# Altium project FPGA_Quatro.PrjPcb
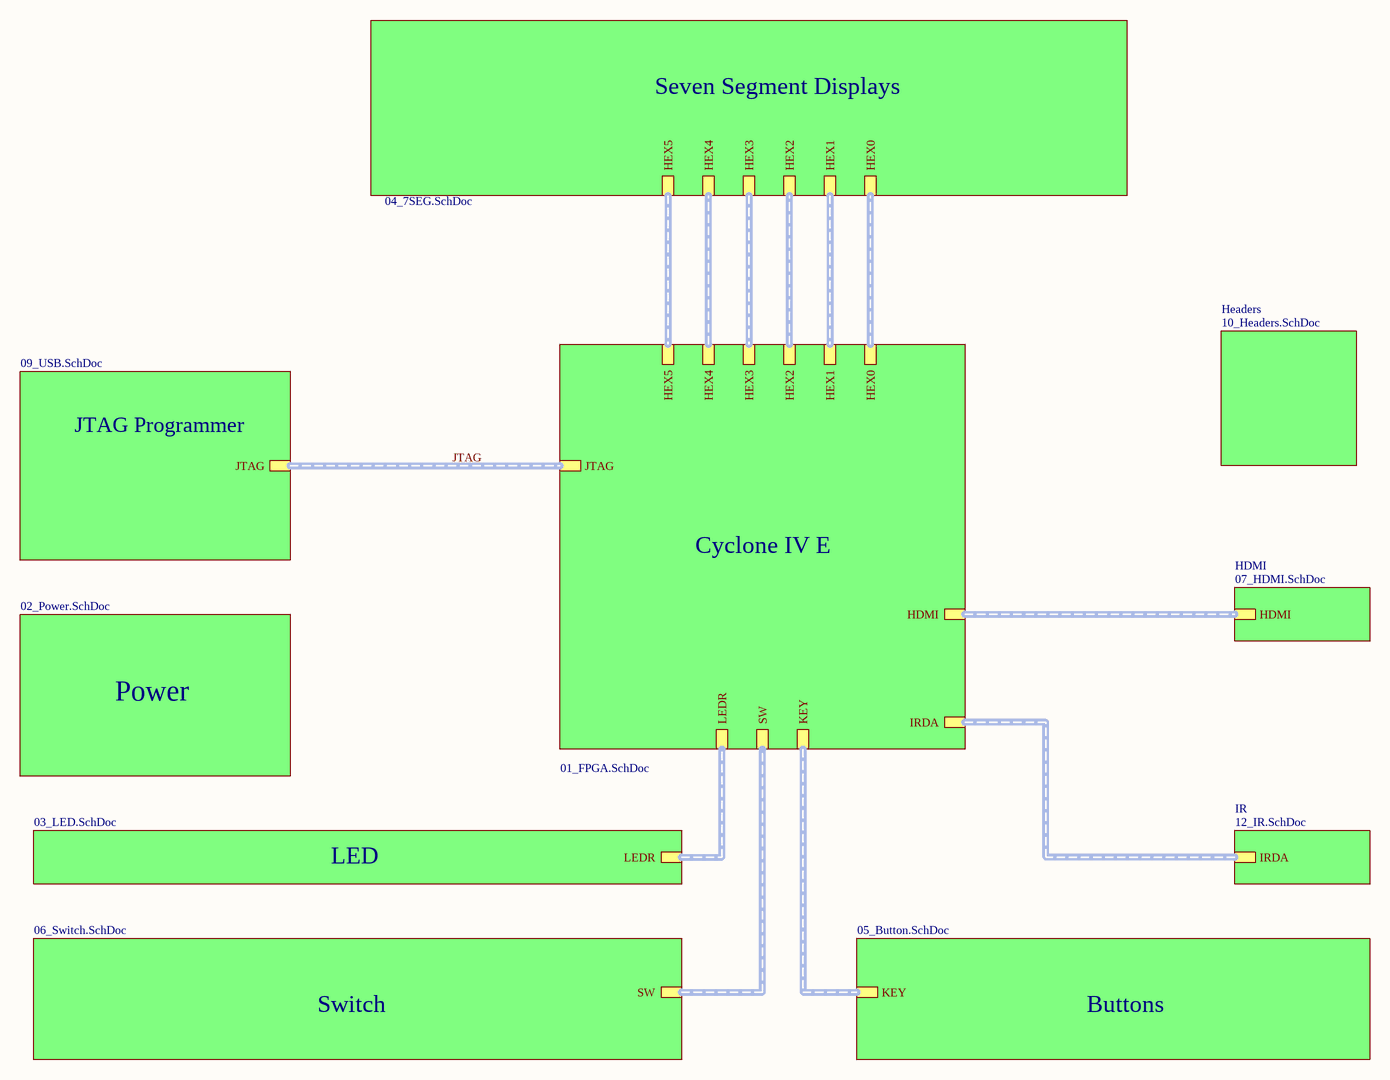
[diagram p0: FPGA_Quatro_SCH_main.SchDoc]
11 sheets, 170 parts. Net scope: hierarchical (ports join the sheet entries above them; power ports are global).
Board file: FPGA_Quatro_PCB.PcbDoc
Sheets:
  FPGA_Quatro_SCH_main.SchDoc
    Cyclone IV E = 01_FPGA.SchDoc
    Power = 02_Power.SchDoc
    LED = 03_LED.SchDoc
    Seven Segment Displays = 04_7SEG.SchDoc
    Buttons = 05_Button.SchDoc
    Switch = 06_Switch.SchDoc
    Headers = 10_Headers.SchDoc
    HDMI = 07_HDMI.SchDoc
    IR = 12_IR.SchDoc
    JTAG Programmer = 09_USB.SchDoc

## Sheet FPGA_Quatro_SCH_main.SchDoc
size A3

### Sub-sheets
Buttons = 05_Button.SchDoc: KEY (harness KEY)
Cyclone IV E = 01_FPGA.SchDoc: JTAG (harness JTAG), LEDR (harness LEDR), SW (harness SW), KEY (harness KEY), HEX4 (harness HEX4), HEX3 (harness HEX3), HEX2 (harness HEX2), HEX0 (harness HEX0), HEX5 (harness HEX5), HEX1 (harness HEX1), HDMI (harness HDMI), IRDA (harness IRDA)
HDMI = 07_HDMI.SchDoc: HDMI (harness HDMI)
Headers = 10_Headers.SchDoc: no entries
IR = 12_IR.SchDoc: IRDA (harness IRDA)
JTAG Programmer = 09_USB.SchDoc: JTAG (harness JTAG)
LED = 03_LED.SchDoc: LEDR (harness LEDR)
Power = 02_Power.SchDoc: no entries
Seven Segment Displays = 04_7SEG.SchDoc: HEX3 (harness HEX3), HEX1 (harness HEX1), HEX0 (harness HEX0), HEX2 (harness HEX2), HEX4 (harness HEX4), HEX5 (harness HEX5)
Switch = 06_Switch.SchDoc: SW (harness SW)

### Buses and harness runs
harness JTAG = sheet Cyclone IV E/JTAG = sheet JTAG Programmer/JTAG
harness sheet Buttons/KEY = sheet Cyclone IV E/KEY
harness sheet Cyclone IV E/HDMI = sheet HDMI/HDMI
harness sheet Cyclone IV E/HEX0 = sheet Seven Segment Displays/HEX0
harness sheet Cyclone IV E/HEX1 = sheet Seven Segment Displays/HEX1
harness sheet Cyclone IV E/HEX2 = sheet Seven Segment Displays/HEX2
harness sheet Cyclone IV E/HEX3 = sheet Seven Segment Displays/HEX3
harness sheet Cyclone IV E/HEX4 = sheet Seven Segment Displays/HEX4
harness sheet Cyclone IV E/HEX5 = sheet Seven Segment Displays/HEX5
harness sheet Cyclone IV E/IRDA = sheet IR/IRDA
harness sheet Cyclone IV E/LEDR = sheet LED/LEDR
harness sheet Cyclone IV E/SW = sheet Switch/SW

## Sheet 01_FPGA.SchDoc
size A2
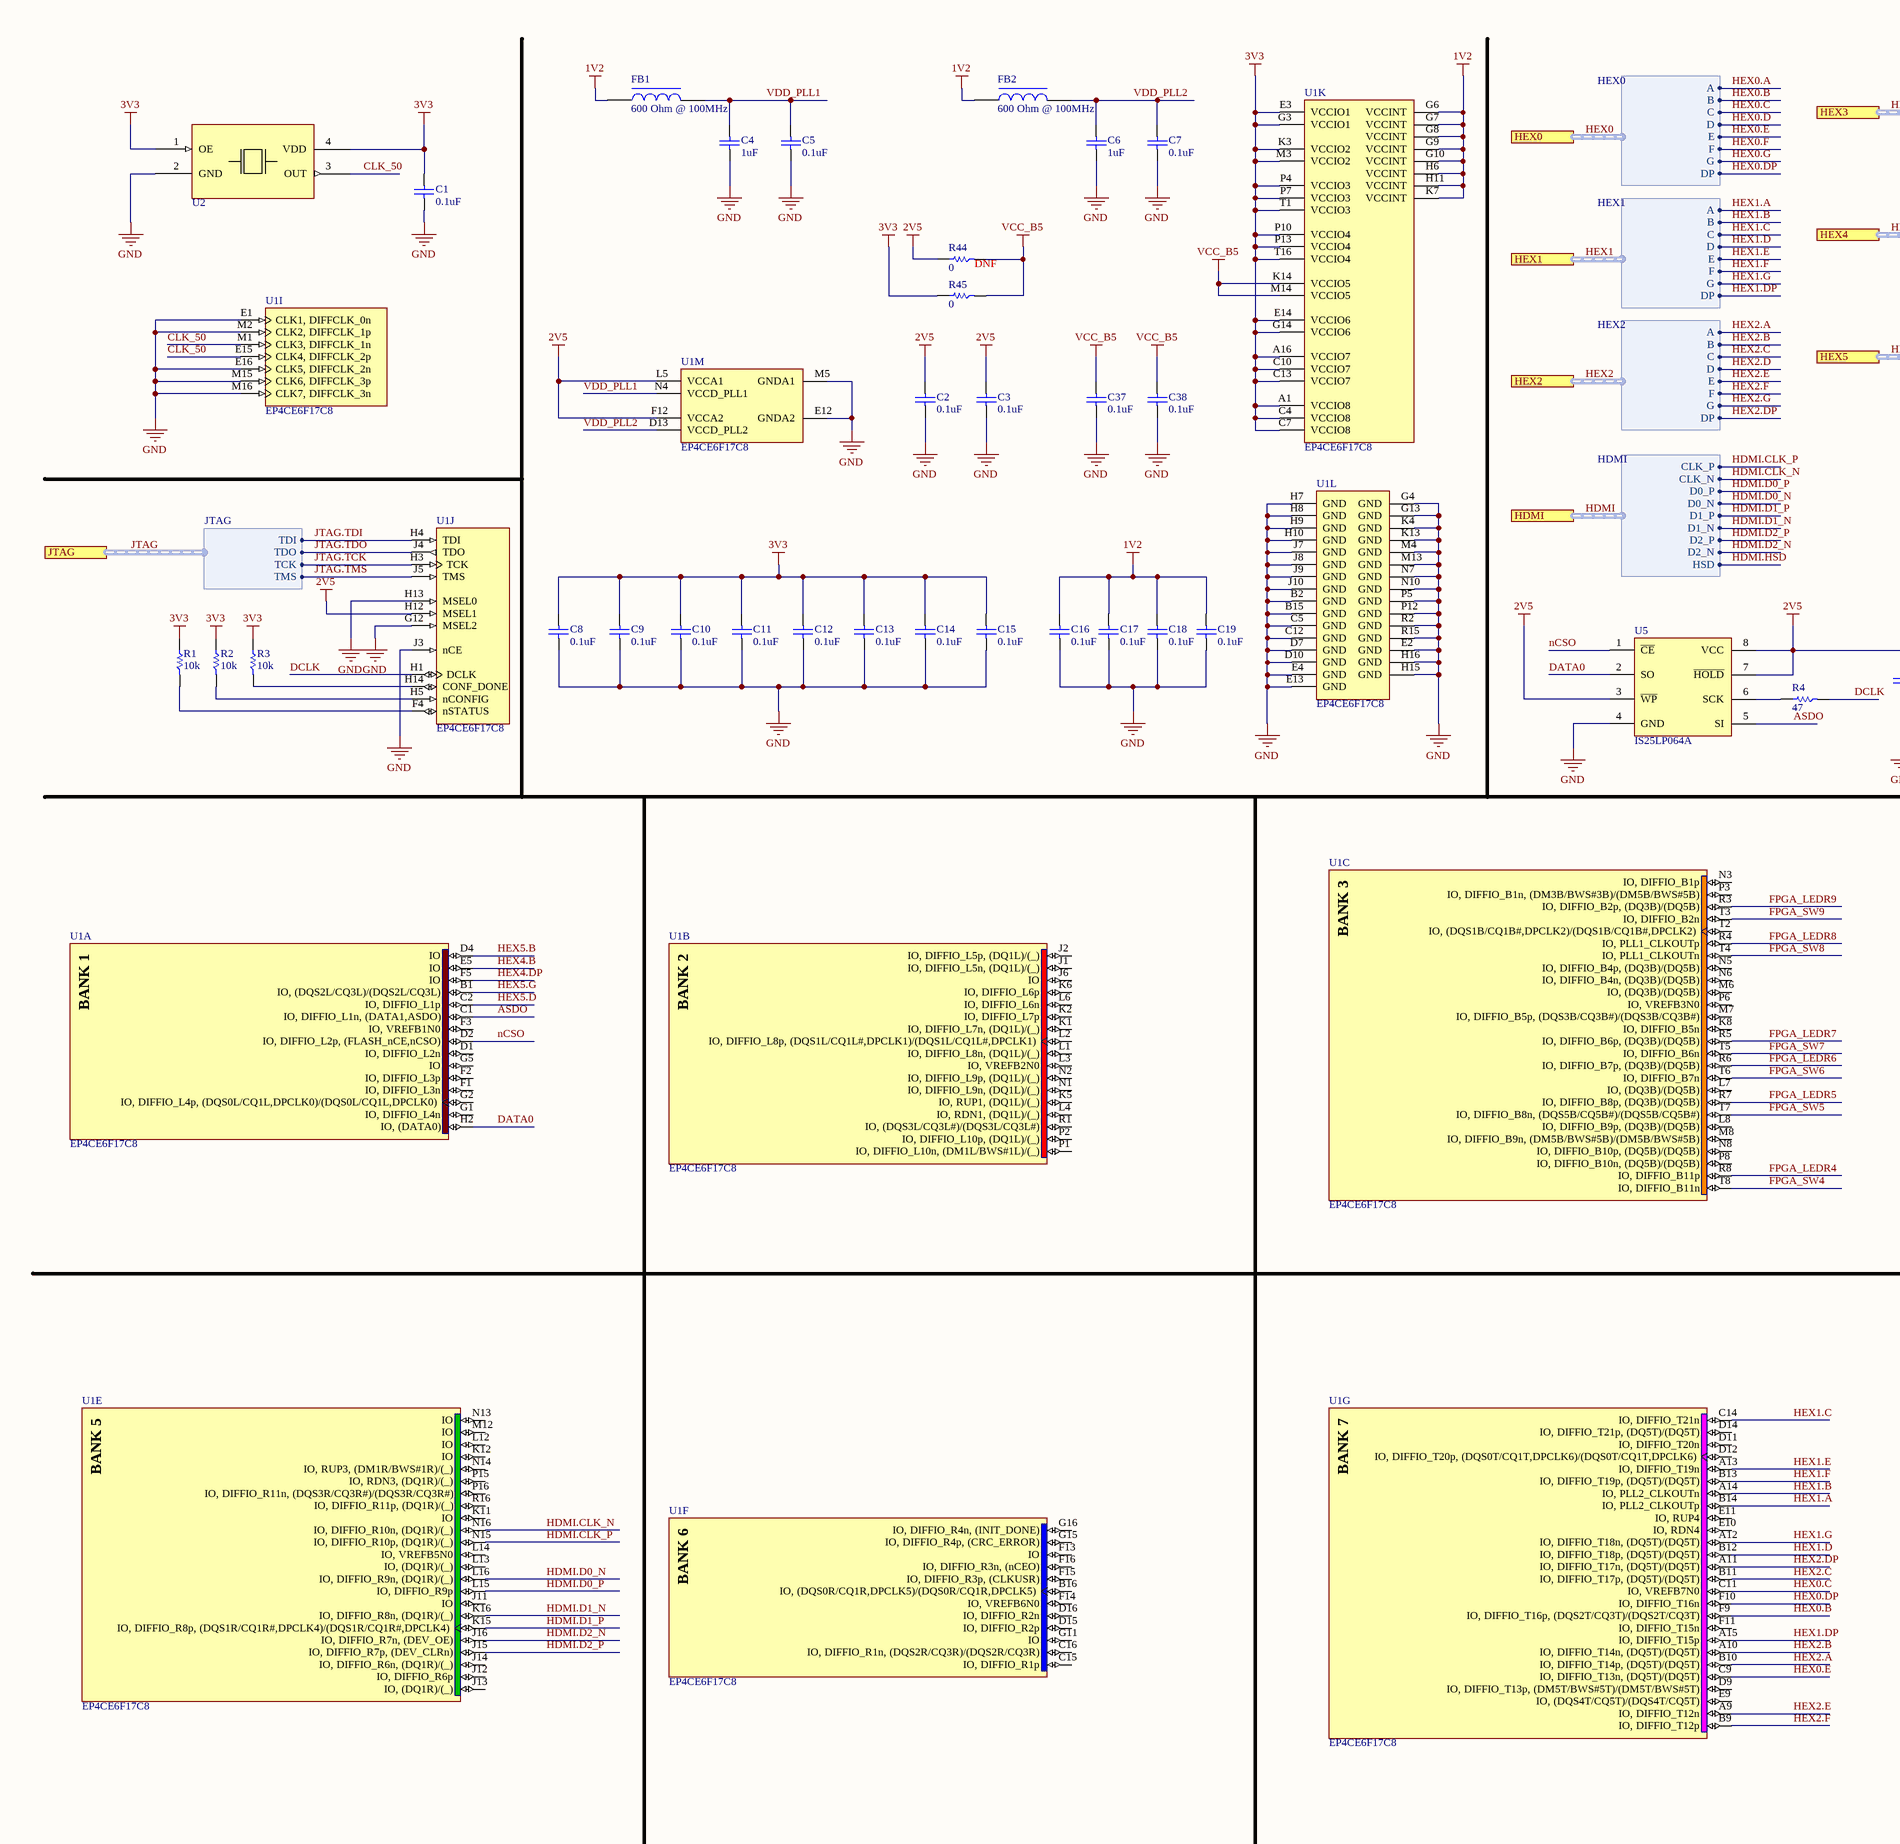
[diagram p1: 01_FPGA.SchDoc, left]
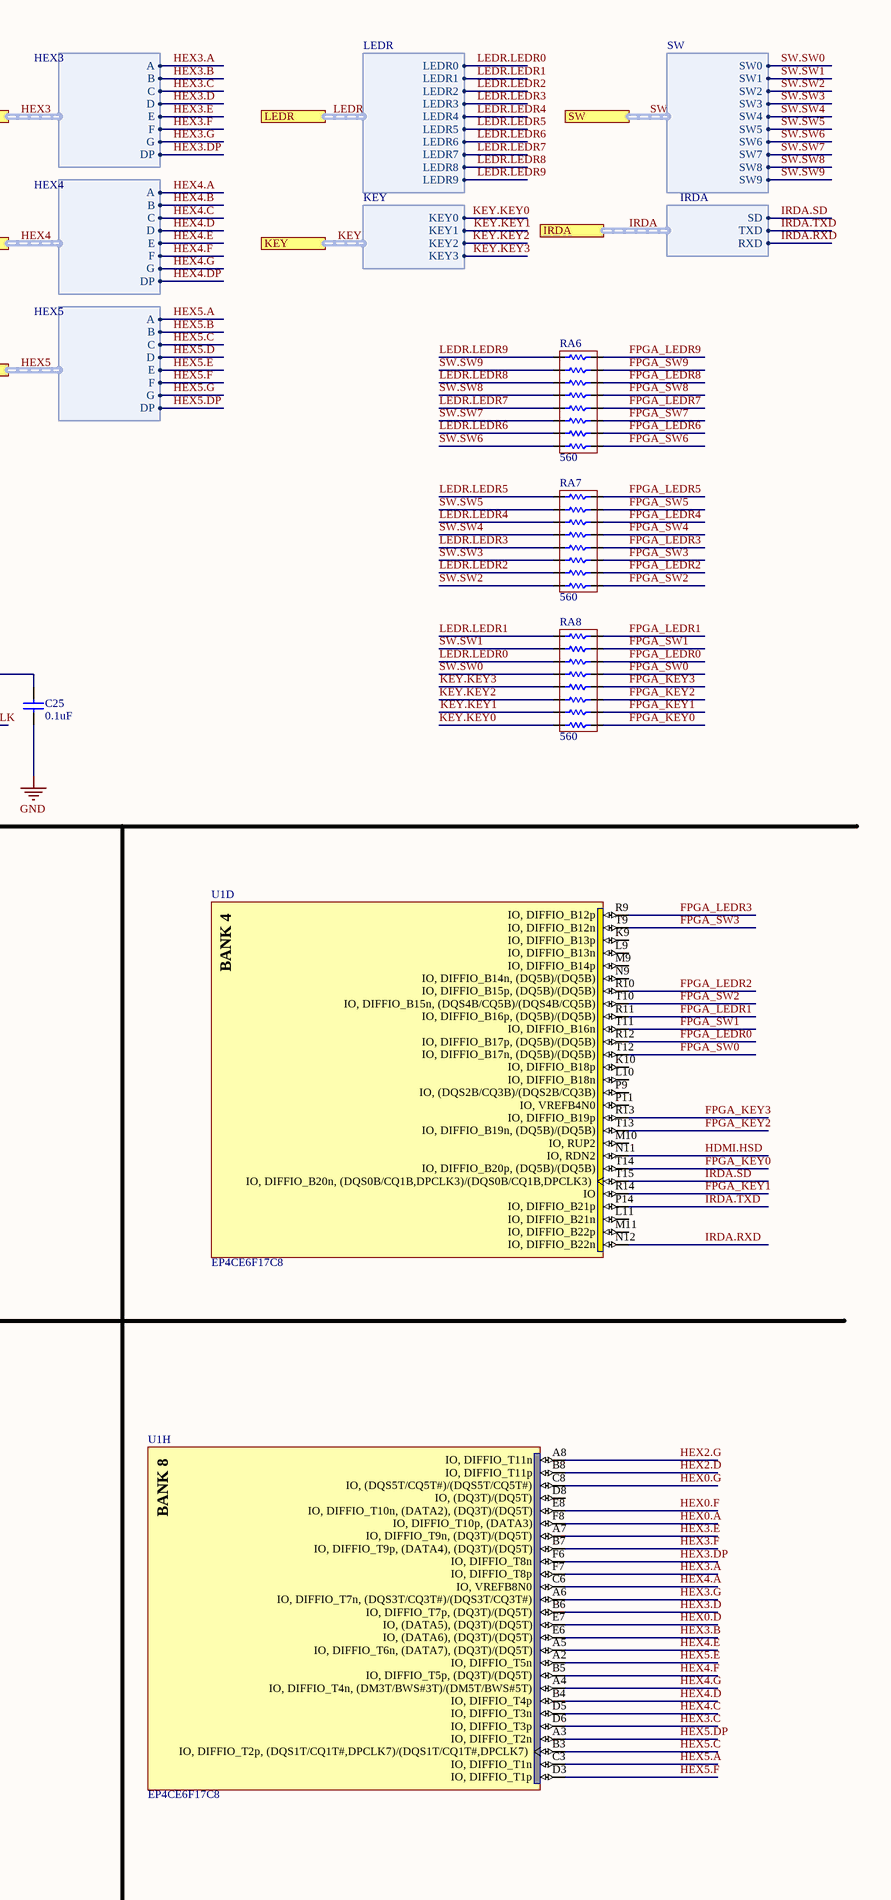
[diagram p2: 01_FPGA.SchDoc, right]

### Parts
C1  0.1uF  [CAP0603R]
C2  0.1uF  [CAP0603R]
C3  0.1uF  [CAP0603R]
C4  1uF  [CAP0603R]
C5  0.1uF  [CAP0603R]
C6  1uF  [CAP0603R]
C7  0.1uF  [CAP0603R]
C8  0.1uF  [CAP0603R]
C9  0.1uF  [CAP0603R]
C10  0.1uF  [CAP0603R]
C11  0.1uF  [CAP0603R]
C12  0.1uF  [CAP0603R]
C13  0.1uF  [CAP0603R]
C14  0.1uF  [CAP0603R]
C15  0.1uF  [CAP0603R]
C16  0.1uF  [CAP0603R]
C17  0.1uF  [CAP0603R]
C18  0.1uF  [CAP0603R]
C19  0.1uF  [CAP0603R]
C25  0.1uF  [CAP0603R]
C37  0.1uF  [CAP0603R]
C38  0.1uF  [CAP0603R]
FB1  600 Ohm @ 100MHz  [RES0805R]
FB2  600 Ohm @ 100MHz  [RES0805R]
R1  10k  [RES0603R]
R2  10k  [RES0603R]
R3  10k  [RES0603R]
R4  47  [RES0603R]
R44  Load: DNF  [RES0402R]  (hidden comment: 0)
R45  0  [RES0402R]
RA6  value 560  [EXB-2HV]  (hidden comment: Resistor Array)
RA7  value 560  [EXB-2HV]  (hidden comment: Resistor Array)
RA8  value 560  [EXB-2HV]  (hidden comment: Resistor Array)
U1  EP4CE6F17C8  [FBGA256]  (parts A,B,C,D,E,F,G,H,I,J,K,L,M of 13)
U2  Oscillator  [CRYSTAL_7x5]  (value not drawn)
U5  IS25LP064A  [SOIC-8]

### Ports
HDMI (harness HDMI), HEX0 (harness HEX0), HEX1 (harness HEX1), HEX2 (harness HEX2), HEX3 (harness HEX3), HEX4 (harness HEX4), HEX5 (harness HEX5), IRDA (harness IRDA), JTAG (harness JTAG), KEY (harness KEY), LEDR (harness LEDR), SW (harness SW)

### Harnesses
JTAG: TDI, TDO, TCK, TMS
LEDR: LEDR0, LEDR1, LEDR2, LEDR3, LEDR4, LEDR5, LEDR6, LEDR7, LEDR8, LEDR9
SW: SW0, SW1, SW2, SW3, SW4, SW5, SW6, SW7, SW8, SW9
KEY: KEY0, KEY1, KEY2, KEY3
HEX0: A, B, C, D, E, F, G, DP
HEX1: A, B, C, D, E, F, G, DP
HEX2: A, B, C, D, E, F, G, DP
HEX3: A, B, C, D, E, F, G, DP
HEX4: A, B, C, D, E, F, G, DP
HEX5: A, B, C, D, E, F, G, DP
HDMI: CLK_P, CLK_N, D0_P, D0_N, D1_P, D1_N, D2_P, D2_N, HSD
IRDA: SD, TXD, RXD

### Nets
1V2: C16.1 C17.1 C18.1 C19.1 FB1.1 FB2.1 U1.G6(VCCINT) U1.G7(VCCINT) U1.G8(VCCINT) U1.G9(VCCINT) U1.G10(VCCINT) U1.H6(VCCINT) U1.H11(VCCINT) U1.K7(VCCINT)
2V5: C2.1 C3.1 C25.1 R44.2 U1.F12(VCCA2) U1.H12(MSEL1) U1.L5(VCCA1) U5.3(~{WP}) U5.7(~{HOLD}) U5.8(VCC)
3V3: C1.1 C8.1 C9.1 C10.1 C11.1 C12.1 C13.1 C14.1 C15.1 R1.2 R2.2 R3.2 R45.2 U1.A1(VCCIO8) U1.A16(VCCIO7) U1.C4(VCCIO8) U1.C7(VCCIO8) U1.C10(VCCIO7) U1.C13(VCCIO7) U1.E3(VCCIO1) U1.E14(VCCIO6) U1.G3(VCCIO1) U1.G14(VCCIO6) U1.K3(VCCIO2) U1.M3(VCCIO2) U1.P4(VCCIO3) U1.P7(VCCIO3) U1.P10(VCCIO4) U1.P13(VCCIO4) U1.T1(VCCIO3) U1.T16(VCCIO4) U2.1(OE) U2.4(VDD)
GND: C1.2 C2.2 C3.2 C4.2 C5.2 C6.2 C7.2 C8.2 C9.2 C10.2 C11.2 C12.2 C13.2 C14.2 C15.2 C16.2 C17.2 C18.2 C19.2 C25.2 C37.2 C38.2 U1.B2(GND) U1.B15(GND) U1.C5(GND) U1.C12(GND) U1.D7(GND) U1.D10(GND) U1.E1(CLK1,_DIFFCLK_0n) U1.E2(GND) U1.E4(GND) U1.E12(GNDA2) U1.E13(GND) U1.E16(CLK5,_DIFFCLK_2n) U1.G4(GND) U1.G12(MSEL2) U1.G13(GND) U1.H7(GND) U1.H8(GND) U1.H9(GND) U1.H10(GND) U1.H13(MSEL0) U1.H15(GND) U1.H16(GND) U1.J3(nCE) U1.J7(GND) U1.J8(GND) U1.J9(GND) U1.J10(GND) U1.K4(GND) U1.K13(GND) U1.M2(CLK2,_DIFFCLK_1p) U1.M4(GND) U1.M5(GNDA1) U1.M13(GND) U1.M15(CLK6,_DIFFCLK_3p) U1.M16(CLK7,_DIFFCLK_3n) U1.N7(GND) U1.N10(GND) U1.P5(GND) U1.P12(GND) U1.R2(GND) U1.R15(GND) U2.2(GND) U5.4(GND)
VCC_B5: C37.1 C38.1 R44.1 R45.1 U1.K14(VCCIO5) U1.M14(VCCIO5)
ASDO: U1.C1(IO,_DIFFIO_L1n,_(DATA1,ASDO)) U5.5(SI)
CLK_50: U1.E15(CLK4,_DIFFCLK_2p) U1.M1(CLK3,_DIFFCLK_1n) U2.3(OUT)
DATA0: U1.H2(IO,_(DATA0)) U5.2(SO)
DCLK: R4.1 U1.H1(DCLK)
FPGA_KEY0: RA8.9 U1.T14(IO,_DIFFIO_B20p,_(DQ5B)/(DQ5B))
FPGA_KEY1: RA8.10 U1.R14(IO)
FPGA_KEY2: RA8.11 U1.T13(IO,_DIFFIO_B19n,_(DQ5B)/(DQ5B))
FPGA_KEY3: RA8.12 U1.R13(IO,_DIFFIO_B19p)
FPGA_LEDR0: RA8.14 U1.R12(IO,_DIFFIO_B17p,_(DQ5B)/(DQ5B))
FPGA_LEDR1: RA8.16 U1.R11(IO,_DIFFIO_B16p,_(DQ5B)/(DQ5B))
FPGA_LEDR2: RA7.10 U1.R10(IO,_DIFFIO_B15p,_(DQ5B)/(DQ5B))
FPGA_LEDR3: RA7.12 U1.R9(IO,_DIFFIO_B12p)
FPGA_LEDR4: RA7.14 U1.R8(IO,_DIFFIO_B11p)
FPGA_LEDR5: RA7.16 U1.R7(IO,_DIFFIO_B8p,_(DQ3B)/(DQ5B))
FPGA_LEDR6: RA6.10 U1.R6(IO,_DIFFIO_B7p,_(DQ3B)/(DQ5B))
FPGA_LEDR7: RA6.12 U1.R5(IO,_DIFFIO_B6p,_(DQ3B)/(DQ5B))
FPGA_LEDR8: RA6.14 U1.R4(IO,_PLL1_CLKOUTp)
FPGA_LEDR9: RA6.16 U1.R3(IO,_DIFFIO_B2p,_(DQ3B)/(DQ5B))
FPGA_SW0: RA8.13 U1.T12(IO,_DIFFIO_B17n,_(DQ5B)/(DQ5B))
FPGA_SW1: RA8.15 U1.T11(IO,_DIFFIO_B16n)
FPGA_SW2: RA7.9 U1.T10(IO,_DIFFIO_B15n,_(DQS4B/CQ5B)/(DQS4B/CQ5B))
FPGA_SW3: RA7.11 U1.T9(IO,_DIFFIO_B12n)
FPGA_SW4: RA7.13 U1.T8(IO,_DIFFIO_B11n)
FPGA_SW5: RA7.15 U1.T7(IO,_DIFFIO_B8n,_(DQS5B/CQ5B#)/(DQS5B/CQ5B#))
FPGA_SW6: RA6.9 U1.T6(IO,_DIFFIO_B7n)
FPGA_SW7: RA6.11 U1.T5(IO,_DIFFIO_B6n)
FPGA_SW8: RA6.13 U1.T4(IO,_PLL1_CLKOUTn)
FPGA_SW9: RA6.15 U1.T3(IO,_DIFFIO_B2n)
HDMI.CLK_N: U1.N16(IO,_DIFFIO_R10n,_(DQ1R)/(_)) ; port HDMI.CLK_N
HDMI.CLK_P: U1.N15(IO,_DIFFIO_R10p,_(DQ1R)/(_)) ; port HDMI.CLK_P
HDMI.D0_N: U1.L16(IO,_DIFFIO_R9n,_(DQ1R)/(_)) ; port HDMI.D0_N
HDMI.D0_P: U1.L15(IO,_DIFFIO_R9p) ; port HDMI.D0_P
HDMI.D1_N: U1.K16(IO,_DIFFIO_R8n,_(DQ1R)/(_)) ; port HDMI.D1_N
HDMI.D1_P: U1.K15(IO,_DIFFIO_R8p,_(DQS1R/CQ1R#,DPCLK4)/(DQS1R/CQ1R#,DPCLK4)) ; port HDMI.D1_P
HDMI.D2_N: U1.J16(IO,_DIFFIO_R7n,_(DEV_OE)) ; port HDMI.D2_N
HDMI.D2_P: U1.J15(IO,_DIFFIO_R7p,_(DEV_CLRn)) ; port HDMI.D2_P
HDMI.HSD: U1.N11(IO,_RDN2) ; port HDMI.HSD
HEX0.A: U1.F8(IO,_DIFFIO_T10p,_(DATA3)) ; port HEX0.A
HEX0.B: U1.F9(IO,_DIFFIO_T16p,_(DQS2T/CQ3T)/(DQS2T/CQ3T)) ; port HEX0.B
HEX0.C: U1.C11(IO,_VREFB7N0) ; port HEX0.C
HEX0.D: U1.E7(IO,_(DATA5),_(DQ3T)/(DQ5T)) ; port HEX0.D
HEX0.DP: U1.F10(IO,_DIFFIO_T16n) ; port HEX0.DP
HEX0.E: U1.C9(IO,_DIFFIO_T13n,_(DQ5T)/(DQ5T)) ; port HEX0.E
HEX0.F: U1.E8(IO,_DIFFIO_T10n,_(DATA2),_(DQ3T)/(DQ5T)) ; port HEX0.F
HEX0.G: U1.C8(IO,_(DQS5T/CQ5T#)/(DQS5T/CQ5T#)) ; port HEX0.G
HEX1.A: U1.B14(IO,_PLL2_CLKOUTp) ; port HEX1.A
HEX1.B: U1.A14(IO,_PLL2_CLKOUTn) ; port HEX1.B
HEX1.C: U1.C14(IO,_DIFFIO_T21n) ; port HEX1.C
HEX1.D: U1.B12(IO,_DIFFIO_T18p,_(DQ5T)/(DQ5T)) ; port HEX1.D
HEX1.DP: U1.A15(IO,_DIFFIO_T15p) ; port HEX1.DP
HEX1.E: U1.A13(IO,_DIFFIO_T19n) ; port HEX1.E
HEX1.F: U1.B13(IO,_DIFFIO_T19p,_(DQ5T)/(DQ5T)) ; port HEX1.F
HEX1.G: U1.A12(IO,_DIFFIO_T18n,_(DQ5T)/(DQ5T)) ; port HEX1.G
HEX2.A: U1.B10(IO,_DIFFIO_T14p,_(DQ5T)/(DQ5T)) ; port HEX2.A
HEX2.B: U1.A10(IO,_DIFFIO_T14n,_(DQ5T)/(DQ5T)) ; port HEX2.B
HEX2.C: U1.B11(IO,_DIFFIO_T17p,_(DQ5T)/(DQ5T)) ; port HEX2.C
HEX2.D: U1.B8(IO,_DIFFIO_T11p) ; port HEX2.D
HEX2.DP: U1.A11(IO,_DIFFIO_T17n,_(DQ5T)/(DQ5T)) ; port HEX2.DP
HEX2.E: U1.A9(IO,_DIFFIO_T12n) ; port HEX2.E
HEX2.F: U1.B9(IO,_DIFFIO_T12p) ; port HEX2.F
HEX2.G: U1.A8(IO,_DIFFIO_T11n) ; port HEX2.G
HEX3.A: U1.F7(IO,_DIFFIO_T8p) ; port HEX3.A
HEX3.B: U1.E6(IO,_(DATA6),_(DQ3T)/(DQ5T)) ; port HEX3.B
HEX3.C: U1.D6(IO,_DIFFIO_T3p) ; port HEX3.C
HEX3.D: U1.B6(IO,_DIFFIO_T7p,_(DQ3T)/(DQ5T)) ; port HEX3.D
HEX3.DP: U1.F6(IO,_DIFFIO_T8n) ; port HEX3.DP
HEX3.E: U1.A7(IO,_DIFFIO_T9n,_(DQ3T)/(DQ5T)) ; port HEX3.E
HEX3.F: U1.B7(IO,_DIFFIO_T9p,_(DATA4),_(DQ3T)/(DQ5T)) ; port HEX3.F
HEX3.G: U1.A6(IO,_DIFFIO_T7n,_(DQS3T/CQ3T#)/(DQS3T/CQ3T#)) ; port HEX3.G
HEX4.A: U1.C6(IO,_VREFB8N0) ; port HEX4.A
HEX4.B: U1.E5(IO) ; port HEX4.B
HEX4.C: U1.D5(IO,_DIFFIO_T3n) ; port HEX4.C
HEX4.D: U1.B4(IO,_DIFFIO_T4p) ; port HEX4.D
HEX4.DP: U1.F5(IO) ; port HEX4.DP
HEX4.E: U1.A5(IO,_DIFFIO_T6n,_(DATA7),_(DQ3T)/(DQ5T)) ; port HEX4.E
HEX4.F: U1.B5(IO,_DIFFIO_T5p,_(DQ3T)/(DQ5T)) ; port HEX4.F
HEX4.G: U1.A4(IO,_DIFFIO_T4n,_(DM3T/BWS#3T)/(DM5T/BWS#5T)) ; port HEX4.G
HEX5.A: U1.C3(IO,_DIFFIO_T1n) ; port HEX5.A
HEX5.B: U1.D4(IO) ; port HEX5.B
HEX5.C: U1.B3(IO,_DIFFIO_T2p,_(DQS1T/CQ1T#,DPCLK7)/(DQS1T/CQ1T#,DPCLK7)) ; port HEX5.C
HEX5.D: U1.C2(IO,_DIFFIO_L1p) ; port HEX5.D
HEX5.DP: U1.A3(IO,_DIFFIO_T2n) ; port HEX5.DP
HEX5.E: U1.A2(IO,_DIFFIO_T5n) ; port HEX5.E
HEX5.F: U1.D3(IO,_DIFFIO_T1p) ; port HEX5.F
HEX5.G: U1.B1(IO,_(DQS2L/CQ3L)/(DQS2L/CQ3L)) ; port HEX5.G
IRDA.RXD: U1.N12(IO,_DIFFIO_B22n) ; port IRDA.RXD
IRDA.SD: U1.T15(IO,_DIFFIO_B20n,_(DQS0B/CQ1B,DPCLK3)/(DQS0B/CQ1B,DPCLK3)) ; port IRDA.SD
IRDA.TXD: U1.P14(IO,_DIFFIO_B21p) ; port IRDA.TXD
JTAG.TCK: U1.H3(TCK) ; port JTAG.TCK
JTAG.TDI: U1.H4(TDI) ; port JTAG.TDI
JTAG.TDO: U1.J4(TDO) ; port JTAG.TDO
JTAG.TMS: U1.J5(TMS) ; port JTAG.TMS
KEY.KEY0: RA8.8 ; port KEY.KEY0
KEY.KEY1: RA8.7 ; port KEY.KEY1
KEY.KEY2: RA8.6 ; port KEY.KEY2
KEY.KEY3: RA8.5 ; port KEY.KEY3
LEDR.LEDR0: RA8.3 ; port LEDR.LEDR0
LEDR.LEDR1: RA8.1 ; port LEDR.LEDR1
LEDR.LEDR2: RA7.7 ; port LEDR.LEDR2
LEDR.LEDR3: RA7.5 ; port LEDR.LEDR3
LEDR.LEDR4: RA7.3 ; port LEDR.LEDR4
LEDR.LEDR5: RA7.1 ; port LEDR.LEDR5
LEDR.LEDR6: RA6.7 ; port LEDR.LEDR6
LEDR.LEDR7: RA6.5 ; port LEDR.LEDR7
LEDR.LEDR8: RA6.3 ; port LEDR.LEDR8
LEDR.LEDR9: RA6.1 ; port LEDR.LEDR9
nCSO: U1.D2(IO,_DIFFIO_L2p,_(FLASH_nCE,nCSO)) U5.1(~{CE})
SW.SW0: RA8.4 ; port SW.SW0
SW.SW1: RA8.2 ; port SW.SW1
SW.SW2: RA7.8 ; port SW.SW2
SW.SW3: RA7.6 ; port SW.SW3
SW.SW4: RA7.4 ; port SW.SW4
SW.SW5: RA7.2 ; port SW.SW5
SW.SW6: RA6.8 ; port SW.SW6
SW.SW7: RA6.6 ; port SW.SW7
SW.SW8: RA6.4 ; port SW.SW8
SW.SW9: RA6.2 ; port SW.SW9
VDD_PLL1: C4.1 C5.1 FB1.2 U1.N4(VCCD_PLL1)
VDD_PLL2: C6.1 C7.1 FB2.2 U1.D13(VCCD_PLL2)
NetR1_1: R1.1 U1.F4(nSTATUS)
NetR2_1: R2.1 U1.H5(nCONFIG)
NetR3_1: R3.1 U1.H14(CONF_DONE)
NetR4_2: R4.2 U5.6(SCK)

Not connected (* = marked no-connect by the designer): U1 B16(IO,_(DQS0R/CQ1R,DPCLK5)/(DQS0R/CQ1R,DPCLK5)) C15(IO,_DIFFIO_R1p) C16(IO,_DIFFIO_R1n,_(DQS2R/CQ3R)/(DQS2R/CQ3R)) D1(IO,_DIFFIO_L2n) D8(IO,_(DQ3T)/(DQ5T)) D9(IO,_DIFFIO_T13p,_(DM5T/BWS#5T)/(DM5T/BWS#5T)) D11(IO,_DIFFIO_T20n) D12(IO,_DIFFIO_T20p,_(DQS0T/CQ1T,DPCLK6)/(DQS0T/CQ1T,DPCLK6)) D14(IO,_DIFFIO_T21p,_(DQ5T)/(DQ5T)) D15(IO,_DIFFIO_R2p) D16(IO,_DIFFIO_R2n) E9(IO,_(DQS4T/CQ5T)/(DQS4T/CQ5T)) E10(IO,_RDN4) E11(IO,_RUP4) F1(IO,_DIFFIO_L3n) F2(IO,_DIFFIO_L3p) F3(IO,_VREFB1N0) F11(IO,_DIFFIO_T15n) F13(IO) F14(IO,_VREFB6N0) F15(IO,_DIFFIO_R3p,_(CLKUSR)) F16(IO,_DIFFIO_R3n,_(nCEO)) G1(IO,_DIFFIO_L4n) G2(IO,_DIFFIO_L4p,_(DQS0L/CQ1L,DPCLK0)/(DQS0L/CQ1L,DPCLK0)) G5(IO) G11(IO) G15(IO,_DIFFIO_R4p,_(CRC_ERROR)) G16(IO,_DIFFIO_R4n,_(INIT_DONE)) J1(IO,_DIFFIO_L5n,_(DQ1L)/(_)) J2(IO,_DIFFIO_L5p,_(DQ1L)/(_)) J6(IO) J11(IO) J12(IO,_DIFFIO_R6p) J13(IO,_(DQ1R)/(_)) J14(IO,_DIFFIO_R6n,_(DQ1R)/(_)) K1(IO,_DIFFIO_L7n,_(DQ1L)/(_)) K2(IO,_DIFFIO_L7p) K5(IO,_RUP1,_(DQ1L)/(_)) K6(IO,_DIFFIO_L6p) K8(IO,_DIFFIO_B5n) K9(IO,_DIFFIO_B13p) K10(IO,_DIFFIO_B18p) K11(IO) K12(IO) L1(IO,_DIFFIO_L8n,_(DQ1L)/(_)) L2(IO,_DIFFIO_L8p,_(DQS1L/CQ1L#,DPCLK1)/(DQS1L/CQ1L#,DPCLK1)) L3(IO,_VREFB2N0) L4(IO,_RDN1,_(DQ1L)/(_)) L6(IO,_DIFFIO_L6n) L7(IO,_(DQ3B)/(DQ5B)) L8(IO,_DIFFIO_B9p,_(DQ3B)/(DQ5B)) L9(IO,_DIFFIO_B13n) L10(IO,_DIFFIO_B18n) L11(IO,_DIFFIO_B21n) L12(IO) L13(IO,_(DQ1R)/(_)) L14(IO,_VREFB5N0) M6(IO,_(DQ3B)/(DQ5B)) M7(IO,_DIFFIO_B5p,_(DQS3B/CQ3B#)/(DQS3B/CQ3B#)) M8(IO,_DIFFIO_B9n,_(DM5B/BWS#5B)/(DM5B/BWS#5B)) M9(IO,_DIFFIO_B14p) M10(IO,_RUP2) M11(IO,_DIFFIO_B22p) M12(IO) N1(IO,_DIFFIO_L9n,_(DQ1L)/(_)) N2(IO,_DIFFIO_L9p,_(DQ1L)/(_)) N3(IO,_DIFFIO_B1p) N5(IO,_DIFFIO_B4p,_(DQ3B)/(DQ5B)) N6(IO,_DIFFIO_B4n,_(DQ3B)/(DQ5B)) N8(IO,_DIFFIO_B10p,_(DQ5B)/(DQ5B)) N9(IO,_DIFFIO_B14n,_(DQ5B)/(DQ5B)) N13(IO) N14(IO,_RUP3,_(DM1R/BWS#1R)/(_)) P1(IO,_DIFFIO_L10n,_(DM1L/BWS#1L)/(_)) P2(IO,_DIFFIO_L10p,_(DQ1L)/(_)) P3(IO,_DIFFIO_B1n,_(DM3B/BWS#3B)/(DM5B/BWS#5B)) P6(IO,_VREFB3N0) P8(IO,_DIFFIO_B10n,_(DQ5B)/(DQ5B)) P9(IO,_(DQS2B/CQ3B)/(DQS2B/CQ3B)) P11(IO,_VREFB4N0) P15(IO,_RDN3,_(DQ1R)/(_)) P16(IO,_DIFFIO_R11n,_(DQS3R/CQ3R#)/(DQS3R/CQ3R#)) R1(IO,_(DQS3L/CQ3L#)/(DQS3L/CQ3L#)) R16(IO,_DIFFIO_R11p,_(DQ1R)/(_)) T2(IO,_(DQS1B/CQ1B#,DPCLK2)/(DQS1B/CQ1B#,DPCLK2))

### Buses and harness runs
harness HDMI = port HDMI
harness HEX0 = port HEX0
harness HEX1 = port HEX1
harness HEX2 = port HEX2
harness HEX3 = port HEX3
harness HEX4 = port HEX4
harness HEX5 = port HEX5
harness IRDA = port IRDA
harness JTAG = port JTAG
harness KEY = port KEY
harness LEDR = port LEDR
harness SW = port SW

### Notes on the sheet
- (in symbol EP4CE6F17C8, part A) BANK 1
- (in symbol EP4CE6F17C8, part B) BANK 2
- (in symbol EP4CE6F17C8, part C) BANK 3
- (in symbol EP4CE6F17C8, part D) BANK 4
- (in symbol EP4CE6F17C8, part E) BANK 5
- (in symbol EP4CE6F17C8, part F) BANK 6
- (in symbol EP4CE6F17C8, part G) BANK 7
- (in symbol EP4CE6F17C8, part H) BANK 8

### Library data of the parts
C1-C19 C25 C37 C38 = C: Capacitor; Class I: Passive; Load: YES; Revision: July-2002: Re-released for DXP Platform.; Supplier 1: Digi-Key; Mount: SMD
  C1-C3 C5 C7-C19 C25 C37 C38: Supplier Part Number 1: 311-3560-1-ND; Value: 0.1uF
  C4 C6: Supplier Part Number 1: 587-1242-1-ND; Value: 1uF
FB1 FB2 = Ferrite_Bead: Ferrite Bead; Load: YES; Supplier 1: Digi-Key; Supplier Part Number 1: 445-172908-1-ND; Value: 600 Ohm @ 100MHz; Mount: SMD
R1-R4 R45 = R: Resistor; Load: YES; Mount: SMD; Supplier 1: Digi-Key
  R1-R3: Supplier Part Number 1: 311-10.0KHRCT-ND; Value: 10k
  R4: Supplier Part Number 1: 311-47GRCT-ND; Value: 47
  R45: Supplier Part Number 1: 311-0.0LRCT-ND; Value: 0
R44 = R: Resistor; Mount: SMD; Supplier 1: Digi-Key; Supplier Part Number 1: 311-0.0LRCT-ND; Value: 0
RA6-RA8 = Res Array: Resistor Array with 8 Isolated Resistors; Num of Resistors: 8; 01 Created By: Thomas Harper (12/03/2017); Load: YES; Type: Isolated; Published: 12-Mar-2018; Publisher: MUEEC; Supplier 1: Digi-Key; Supplier Part Number 1: Y1561CT-ND; Mount: SMD
U1 = EP4CE6F17C8: Cyclone IV Family FPGA, 2V Core, 179 I/O Pins, 2 PLLs, 256-Pin FBGA, Speed Grade 8, Commercial Grade; Load: YES; Published: 3-May-2010; DatasheetVersion: ver1.2, Mar-2010; PackageVersion: ver16.0, Dec-2009; PackageReference: FBGA256; Publisher: Altium Limited; PackageDescription: 256-Ball FineLine Ball Grid Array (FBGA256) - Option 1 - Wire Bond; Supplier 1: Digi-Key; Supplier Part Number 1: 544-2828-ND; Code_JEDEC: MS-034-AAF-1; Code_IPC: BGA100P16X16-256; ComponentLink1Description: Manufacturer Link; ComponentLink1URL: http://www.altera.com/; ComponentLink2Description: Handbook; ComponentLink2URL: http://www.altera.com/literature/hb/cyclone-iv/cyclone4-handbook.pdf; ComponentLink3Description: Pinout Specification; ComponentLink3URL: http://www.altera.com/literature/lit-dp.jsp?category=cyc%204&showspreadsheet=y; ComponentLink4Description: Packaging Specification; ComponentLink4URL: http://www.altera.com/literature/ds/dspkg.pdf; Mount: SMD
U2 = CLK_50M: OSC 50MHZ 3.3V SMD; Load: YES; Supplier 1: Digi-Key; Supplier Part Number 1: 535-9330-1-ND; Mount: SMD
U5 = IS25LP064A: 64Mb Serial Flash Memory; Load: YES; Supplier 1: Digi-Key; Supplier Part Number 1: 706-1440-5-ND; Mount: SMD

## Sheet 02_Power.SchDoc
size A4
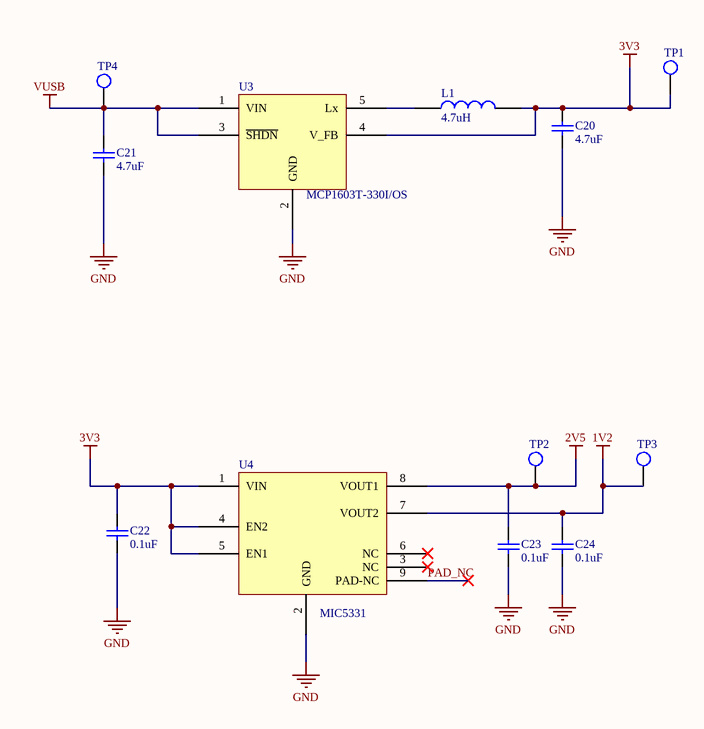
[diagram p3: 02_Power.SchDoc]

### Parts
C20  4.7uF  [CAP0805R]
C21  4.7uF  [CAP0805R]
C22  0.1uF  [CAP0402R]
C23  0.1uF  [CAP0402R]
C24  0.1uF  [CAP0402R]
L1  4.7uH  [744031004]
TP1  TestPoint  [TestPoint]  (value not drawn)  (no BOM)
TP2  TestPoint  [TestPoint]  (value not drawn)  (no BOM)
TP3  TestPoint  [TestPoint]  (value not drawn)  (no BOM)
TP4  TestPoint  [TestPoint]  (value not drawn)  (no BOM)
U3  MCP1603T-330I/OS  [SOT23-5]
U4  MIC5331  [TDFN22]

### Nets
1V2: C24.1 TP3.0(TP) U4.7(VOUT2)
2V5: C23.1 TP2.0(TP) U4.8(VOUT1)
3V3: C20.1 C22.1 L1.2 TP1.0(TP) U3.4(V_FB) U4.1(VIN) U4.4(EN2) U4.5(EN1)
GND: C20.2 C21.2 C22.2 C23.2 C24.2 U3.2(GND) U4.2(GND)
VUSB: C21.1 TP4.0(TP) U3.1(VIN) U3.3(~{SHDN})
PAD_NC: U4.9(PAD-NC)
NetL1_1: L1.1 U3.5(Lx)

Not connected (* = marked no-connect by the designer): U4 3(NC)* 6(NC)*

### Library data of the parts
C20-C24 = C: Capacitor; Class I: Passive; Load: YES; Revision: July-2002: Re-released for DXP Platform.; Supplier 1: Digi-Key; Mount: SMD
  C20 C21: Supplier Part Number 1: 445-14527-2-ND; Value: 4.7uF
  C22-C24: Supplier Part Number 1: 311-3560-1-ND; Value: 0.1uF
L1 = L: Inductor; Load: YES; Supplier 1: Digi-Key; Supplier Part Number 1: 732-1008-1-ND; Value: 4.7uH; Mount: SMD
TP1-TP4 = TestPoint: Test Point; Load: YES
U3 = MCP1603T-330I/OS: 3.3V 500mA Buck Converter; Load: YES; Supplier 1: Digi-Key; Supplier Part Number 1: MCP1603T-330I/OSCT-ND; Published: 12-Mar-2018; Publisher: MUEEC
U4 = MIC5331: 1.2V, 2.5V 300mA LDO; Load: YES; Supplier 1: Digi-Key; Supplier Part Number 1: 576-3150-1-ND; Mount: SMD

## Sheet 03_LED.SchDoc
size A4
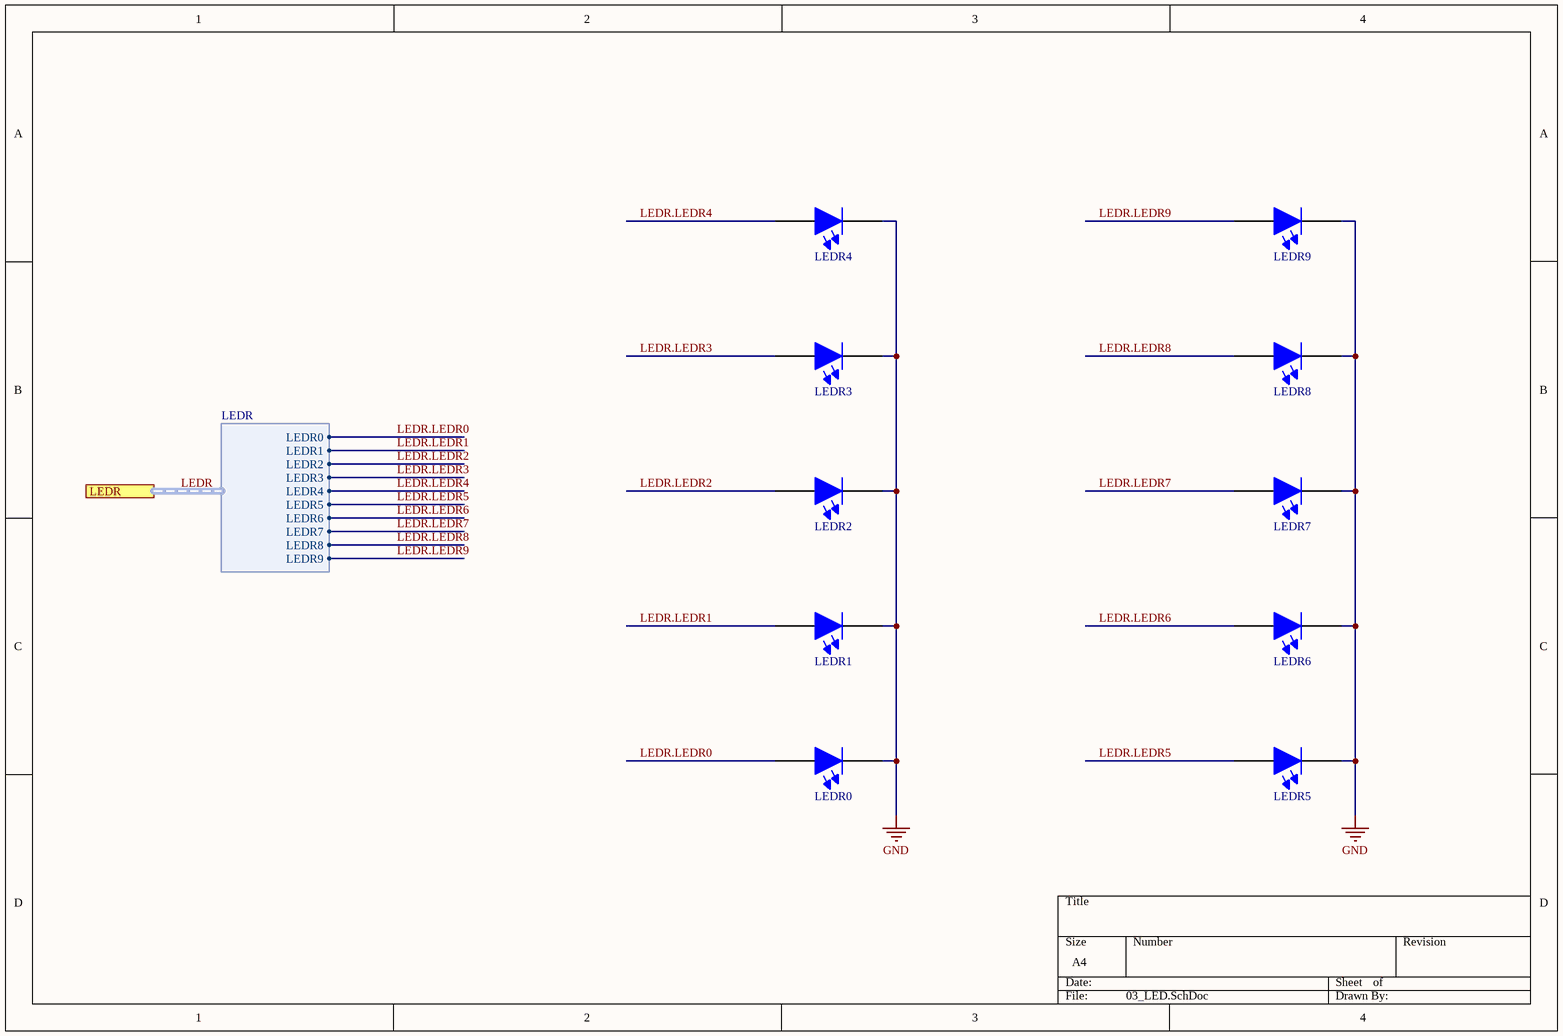
[diagram p4: 03_LED.SchDoc]

### Parts
LEDR0  LED  [0805D-RED]  (value not drawn)
LEDR1  LED  [0805D-RED]  (value not drawn)
LEDR2  LED  [0805D-RED]  (value not drawn)
LEDR3  LED  [0805D-RED]  (value not drawn)
LEDR4  LED  [0805D-RED]  (value not drawn)
LEDR5  LED  [0805D-RED]  (value not drawn)
LEDR6  LED  [0805D-RED]  (value not drawn)
LEDR7  LED  [0805D-RED]  (value not drawn)
LEDR8  LED  [0805D-RED]  (value not drawn)
LEDR9  LED  [0805D-RED]  (value not drawn)

### Ports
LEDR (harness LEDR)

### Harnesses
LEDR: LEDR0, LEDR1, LEDR2, LEDR3, LEDR4, LEDR5, LEDR6, LEDR7, LEDR8, LEDR9

### Nets
GND: LEDR0.K(CATHODE) LEDR1.K(CATHODE) LEDR2.K(CATHODE) LEDR3.K(CATHODE) LEDR4.K(CATHODE) LEDR5.K(CATHODE) LEDR6.K(CATHODE) LEDR7.K(CATHODE) LEDR8.K(CATHODE) LEDR9.K(CATHODE)
LEDR.LEDR0: LEDR0.A(ANODE) ; port LEDR.LEDR0
LEDR.LEDR1: LEDR1.A(ANODE) ; port LEDR.LEDR1
LEDR.LEDR2: LEDR2.A(ANODE) ; port LEDR.LEDR2
LEDR.LEDR3: LEDR3.A(ANODE) ; port LEDR.LEDR3
LEDR.LEDR4: LEDR4.A(ANODE) ; port LEDR.LEDR4
LEDR.LEDR5: LEDR5.A(ANODE) ; port LEDR.LEDR5
LEDR.LEDR6: LEDR6.A(ANODE) ; port LEDR.LEDR6
LEDR.LEDR7: LEDR7.A(ANODE) ; port LEDR.LEDR7
LEDR.LEDR8: LEDR8.A(ANODE) ; port LEDR.LEDR8
LEDR.LEDR9: LEDR9.A(ANODE) ; port LEDR.LEDR9

### Buses and harness runs
harness LEDR = port LEDR

### Library data of the parts
LEDR0-LEDR9 = LED_SMD_Generic: Generic LED; 01 Created By: Thomas Harper; 02 Reviewed By: Rodrigo Maureira @ 2018-04-05; Load: YES; Published: 12-Mar-2018; Publisher: MUEEC; Supplier 1: Digi-Key; Supplier Part Number 1: 732-4984-1-ND; Mount: SMD

## Sheet 04_7SEG.SchDoc
size A4
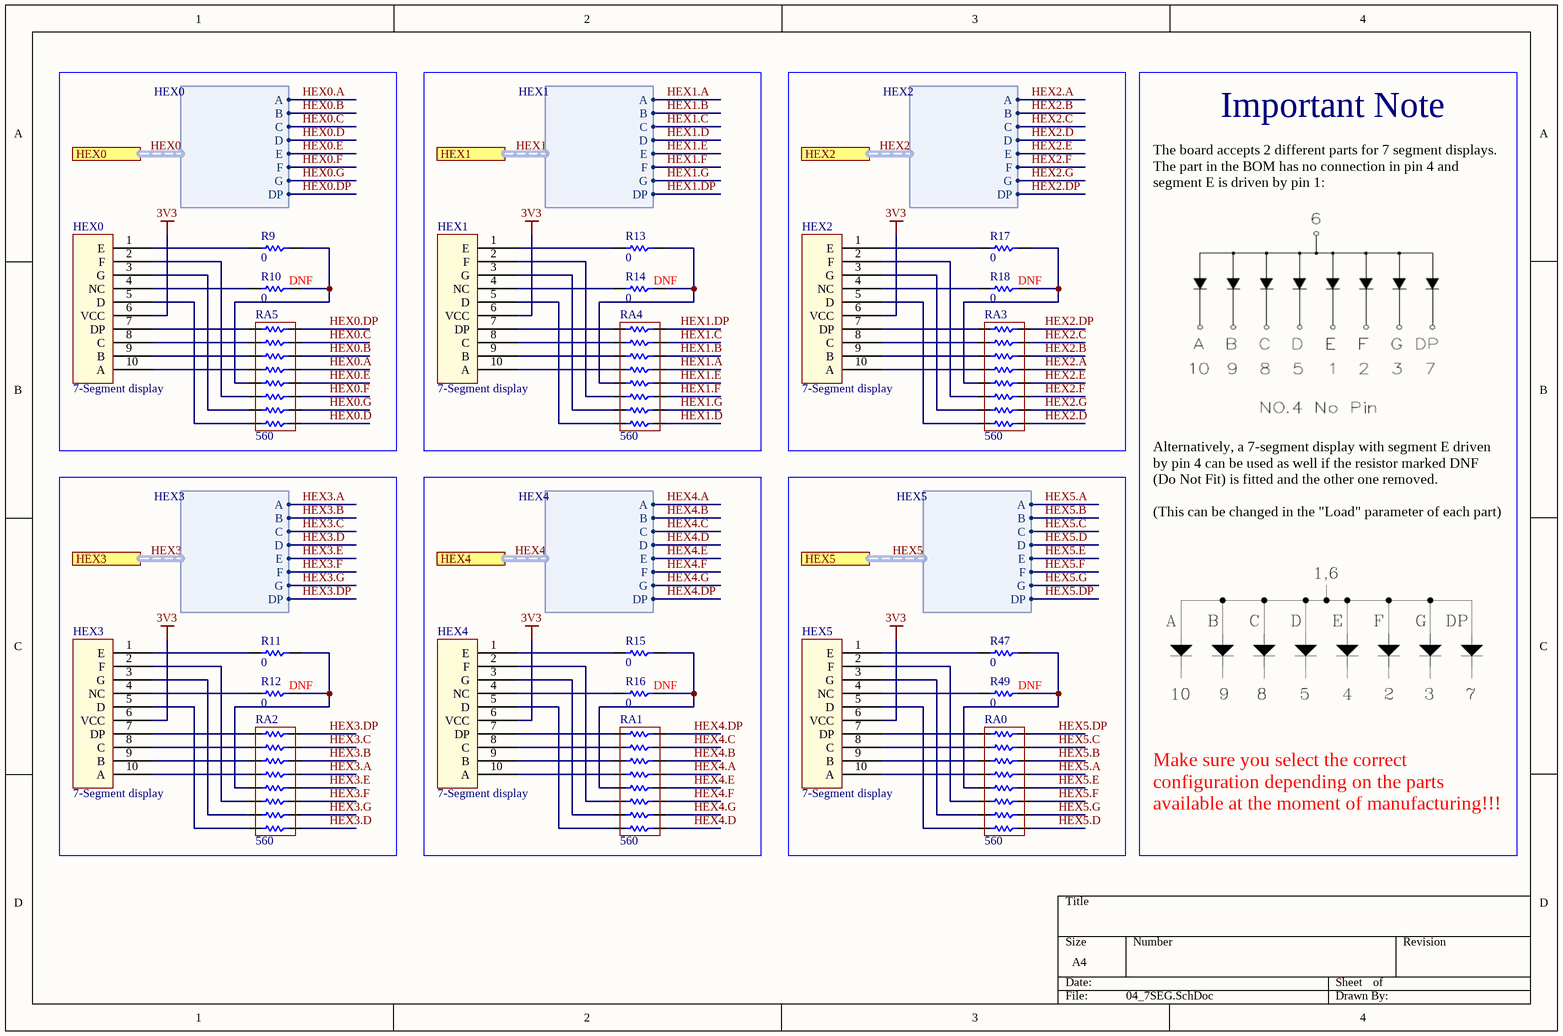
[diagram p5: 04_7SEG.SchDoc]

### Parts
HEX0  7-Segment display  [Seven_Seg_INND-TS40]
HEX1  7-Segment display  [Seven_Seg_INND-TS40]
HEX2  7-Segment display  [Seven_Seg_INND-TS40]
HEX3  7-Segment display  [Seven_Seg_INND-TS40]
HEX4  7-Segment display  [Seven_Seg_INND-TS40]
HEX5  7-Segment display  [Seven_Seg_INND-TS40]
R9  0  [RES0402R]
R10  Load: DNF  [RES0402R]  (hidden comment: 0)
R11  0  [RES0402R]
R12  Load: DNF  [RES0402R]  (hidden comment: 0)
R13  0  [RES0402R]
R14  Load: DNF  [RES0402R]  (hidden comment: 0)
R15  0  [RES0402R]
R16  Load: DNF  [RES0402R]  (hidden comment: 0)
R17  0  [RES0402R]
R18  Load: DNF  [RES0402R]  (hidden comment: 0)
R47  0  [RES0402R]
R49  Load: DNF  [RES0402R]  (hidden comment: 0)
RA0  value 560  [EXB-2HV]  (hidden comment: Resistor Array)
RA1  value 560  [EXB-2HV]  (hidden comment: Resistor Array)
RA2  value 560  [EXB-2HV]  (hidden comment: Resistor Array)
RA3  value 560  [EXB-2HV]  (hidden comment: Resistor Array)
RA4  value 560  [EXB-2HV]  (hidden comment: Resistor Array)
RA5  value 560  [EXB-2HV]  (hidden comment: Resistor Array)

### Ports
HEX0 (harness HEX0), HEX1 (harness HEX1), HEX2 (harness HEX2), HEX3 (harness HEX3), HEX4 (harness HEX4), HEX5 (harness HEX5)

### Harnesses
HEX0: A, B, C, D, E, F, G, DP
HEX1: A, B, C, D, E, F, G, DP
HEX2: A, B, C, D, E, F, G, DP
HEX3: A, B, C, D, E, F, G, DP
HEX4: A, B, C, D, E, F, G, DP
HEX5: A, B, C, D, E, F, G, DP

### Nets
3V3: HEX0.6(VCC) HEX1.6(VCC) HEX2.6(VCC) HEX3.6(VCC) HEX4.6(VCC) HEX5.6(VCC)
HEX0.A: RA5.13 ; port HEX0.A
HEX0.B: RA5.14 ; port HEX0.B
HEX0.C: RA5.15 ; port HEX0.C
HEX0.D: RA5.9 ; port HEX0.D
HEX0.DP: RA5.16 ; port HEX0.DP
HEX0.E: RA5.12 ; port HEX0.E
HEX0.F: RA5.11 ; port HEX0.F
HEX0.G: RA5.10 ; port HEX0.G
HEX1.A: RA4.13 ; port HEX1.A
HEX1.B: RA4.14 ; port HEX1.B
HEX1.C: RA4.15 ; port HEX1.C
HEX1.D: RA4.9 ; port HEX1.D
HEX1.DP: RA4.16 ; port HEX1.DP
HEX1.E: RA4.12 ; port HEX1.E
HEX1.F: RA4.11 ; port HEX1.F
HEX1.G: RA4.10 ; port HEX1.G
HEX2.A: RA3.13 ; port HEX2.A
HEX2.B: RA3.14 ; port HEX2.B
HEX2.C: RA3.15 ; port HEX2.C
HEX2.D: RA3.9 ; port HEX2.D
HEX2.DP: RA3.16 ; port HEX2.DP
HEX2.E: RA3.12 ; port HEX2.E
HEX2.F: RA3.11 ; port HEX2.F
HEX2.G: RA3.10 ; port HEX2.G
HEX3.A: RA2.13 ; port HEX3.A
HEX3.B: RA2.14 ; port HEX3.B
HEX3.C: RA2.15 ; port HEX3.C
HEX3.D: RA2.9 ; port HEX3.D
HEX3.DP: RA2.16 ; port HEX3.DP
HEX3.E: RA2.12 ; port HEX3.E
HEX3.F: RA2.11 ; port HEX3.F
HEX3.G: RA2.10 ; port HEX3.G
HEX4.A: RA1.13 ; port HEX4.A
HEX4.B: RA1.14 ; port HEX4.B
HEX4.C: RA1.15 ; port HEX4.C
HEX4.D: RA1.9 ; port HEX4.D
HEX4.DP: RA1.16 ; port HEX4.DP
HEX4.E: RA1.12 ; port HEX4.E
HEX4.F: RA1.11 ; port HEX4.F
HEX4.G: RA1.10 ; port HEX4.G
HEX5.A: RA0.13 ; port HEX5.A
HEX5.B: RA0.14 ; port HEX5.B
HEX5.C: RA0.15 ; port HEX5.C
HEX5.D: RA0.9 ; port HEX5.D
HEX5.DP: RA0.16 ; port HEX5.DP
HEX5.E: RA0.12 ; port HEX5.E
HEX5.F: RA0.11 ; port HEX5.F
HEX5.G: RA0.10 ; port HEX5.G
NetHEX0_1: HEX0.1(E) R9.2
NetHEX0_2: HEX0.2(F) RA5.6
NetHEX0_3: HEX0.3(G) RA5.7
NetHEX0_4: HEX0.4(NC) R10.2
NetHEX0_5: HEX0.5(D) RA5.8
NetHEX0_7: HEX0.7(DP) RA5.1
NetHEX0_8: HEX0.8(C) RA5.2
NetHEX0_9: HEX0.9(B) RA5.3
NetHEX0_10: HEX0.10(A) RA5.4
NetHEX1_1: HEX1.1(E) R13.2
NetHEX1_2: HEX1.2(F) RA4.6
NetHEX1_3: HEX1.3(G) RA4.7
NetHEX1_4: HEX1.4(NC) R14.2
NetHEX1_5: HEX1.5(D) RA4.8
NetHEX1_7: HEX1.7(DP) RA4.1
NetHEX1_8: HEX1.8(C) RA4.2
NetHEX1_9: HEX1.9(B) RA4.3
NetHEX1_10: HEX1.10(A) RA4.4
NetHEX2_1: HEX2.1(E) R17.2
NetHEX2_2: HEX2.2(F) RA3.6
NetHEX2_3: HEX2.3(G) RA3.7
NetHEX2_4: HEX2.4(NC) R18.2
NetHEX2_5: HEX2.5(D) RA3.8
NetHEX2_7: HEX2.7(DP) RA3.1
NetHEX2_8: HEX2.8(C) RA3.2
NetHEX2_9: HEX2.9(B) RA3.3
NetHEX2_10: HEX2.10(A) RA3.4
NetHEX3_1: HEX3.1(E) R11.2
NetHEX3_2: HEX3.2(F) RA2.6
NetHEX3_3: HEX3.3(G) RA2.7
NetHEX3_4: HEX3.4(NC) R12.2
NetHEX3_5: HEX3.5(D) RA2.8
NetHEX3_7: HEX3.7(DP) RA2.1
NetHEX3_8: HEX3.8(C) RA2.2
NetHEX3_9: HEX3.9(B) RA2.3
NetHEX3_10: HEX3.10(A) RA2.4
NetHEX4_1: HEX4.1(E) R15.2
NetHEX4_2: HEX4.2(F) RA1.6
NetHEX4_3: HEX4.3(G) RA1.7
NetHEX4_4: HEX4.4(NC) R16.2
NetHEX4_5: HEX4.5(D) RA1.8
NetHEX4_7: HEX4.7(DP) RA1.1
NetHEX4_8: HEX4.8(C) RA1.2
NetHEX4_9: HEX4.9(B) RA1.3
NetHEX4_10: HEX4.10(A) RA1.4
NetHEX5_1: HEX5.1(E) R47.2
NetHEX5_2: HEX5.2(F) RA0.6
NetHEX5_3: HEX5.3(G) RA0.7
NetHEX5_4: HEX5.4(NC) R49.2
NetHEX5_5: HEX5.5(D) RA0.8
NetHEX5_7: HEX5.7(DP) RA0.1
NetHEX5_8: HEX5.8(C) RA0.2
NetHEX5_9: HEX5.9(B) RA0.3
NetHEX5_10: HEX5.10(A) RA0.4
NetR9_1: R9.1 R10.1 RA5.5
NetR11_1: R11.1 R12.1 RA2.5
NetR13_1: R13.1 R14.1 RA4.5
NetR15_1: R15.1 R16.1 RA1.5
NetR17_1: R17.1 R18.1 RA3.5
NetR47_1: R47.1 R49.1 RA0.5

### Buses and harness runs
harness HEX0 = port HEX0
harness HEX1 = port HEX1
harness HEX2 = port HEX2
harness HEX3 = port HEX3
harness HEX4 = port HEX4
harness HEX5 = port HEX5

### Notes on the sheet
- Important Note
- The board accepts 2 different parts for 7 segment displays. The part in the BOM has no connection in pin 4 and segment E is driven by pin 1:
- Alternatively, a 7-segment display with segment E driven by pin 4 can be used as well if the resistor marked DNF (Do Not Fit) is fitted and the other one removed.
  (This can be changed in the "Load" parameter of each part)
- Make sure you select the correct configuration depending on the parts available at the moment of manufacturing!!!

### Library data of the parts
HEX0-HEX5 = SevenSeg: 01 Created By: Thomas Harper (12/03/2017); 02 Reviewed By: Rodrigo Maureira (27/03/2018); Load: YES; Color: Red; Published: 12-Mar-2018; Publisher: MUEEC; Supplier 1: Digi-Key; Supplier Part Number 1: 1830-1152-ND; Type: Common Anode; Mount: T/H
R9 R11 R13 R15 R17 R47 = R: Resistor; Load: YES; Mount: SMD; Supplier 1: Digi-Key; Supplier Part Number 1: 311-0.0LRCT-ND; Value: 0
R10 R12 R14 R16 R18 R49 = R: Resistor; Mount: SMD; Supplier 1: Digi-Key; Supplier Part Number 1: 311-0.0LRCT-ND; Value: 0
RA0-RA4 = Res Array: Resistor Array with 8 Isolated Resistors; Num of Resistors: 8; Load: YES; Type: Isolated; Supplier 1: Digi-Key; Supplier Part Number 1: Y1561CT-ND; Mount: SMD
RA5 = Res Array: Resistor Array with 8 Isolated Resistors; Num of Resistors: 8; 01 Created By: Thomas Harper (12/03/2017); 02 Reviewed By: Rodrigo Maureira (27/03/2018); Load: YES; Type: Isolated; Published: 12-Mar-2018; Publisher: MUEEC; Supplier 1: Digi-Key; Supplier Part Number 1: Y1561CT-ND

## Sheet 05_Button.SchDoc
size A4
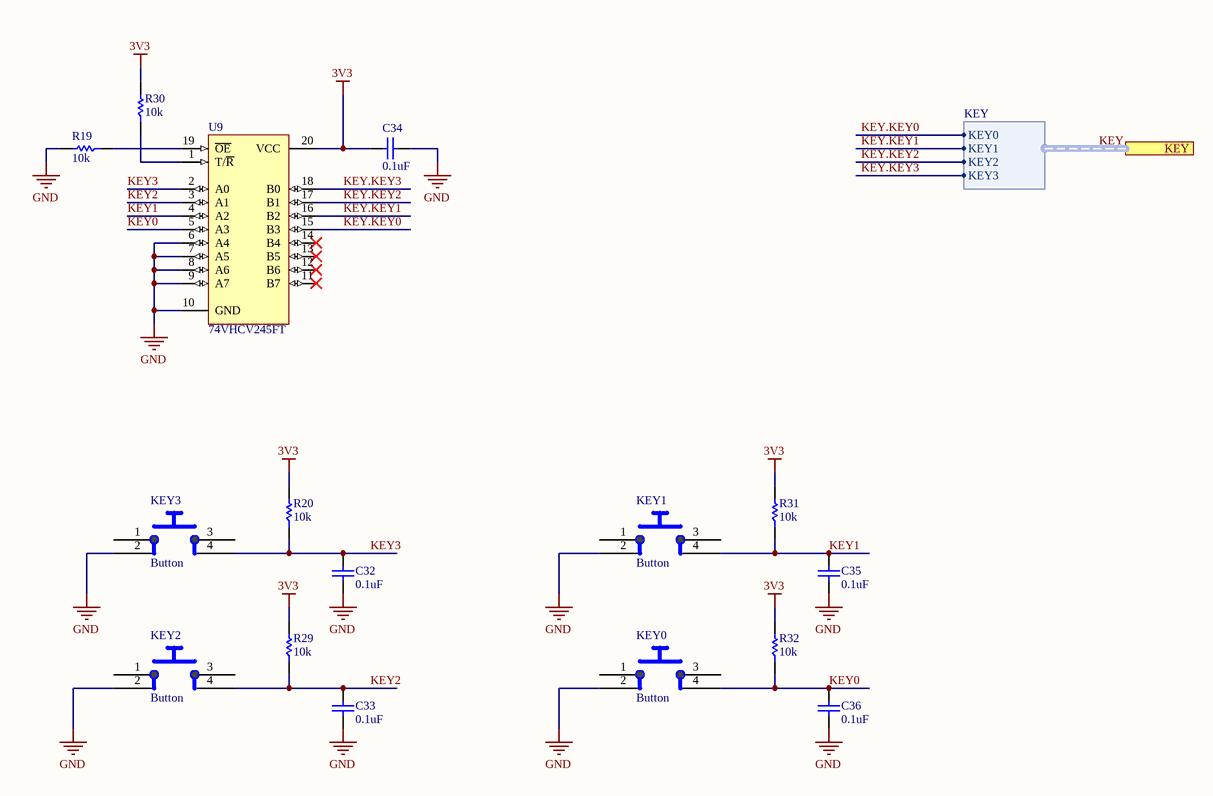
[diagram p6: 05_Button.SchDoc]

### Parts
C32  0.1uF  [CAP0603R]
C33  0.1uF  [CAP0603R]
C34  0.1uF  [CAP0603R]
C35  0.1uF  [CAP0603R]
C36  0.1uF  [CAP0603R]
KEY0  Button  [But_PTS645SMT]
KEY1  Button  [But_PTS645SMT]
KEY2  Button  [But_PTS645SMT]
KEY3  Button  [But_PTS645SMT]
R19  10k  [RES0603R]
R20  10k  [RES0603R]
R29  10k  [RES0603R]
R30  10k  [RES0603R]
R31  10k  [RES0603R]
R32  10k  [RES0603R]
U9  74VHCV245FT  [TSSOP20B]

### Ports
KEY (harness KEY)

### Harnesses
KEY: KEY0, KEY1, KEY2, KEY3

### Nets
3V3: C34.1 R20.2 R29.2 R30.2 R31.2 R32.2 U9.20(VCC)
GND: C32.1 C33.1 C34.2 C35.1 C36.1 KEY0.2 KEY1.2 KEY2.2 KEY3.2 R19.2 U9.6(A4) U9.7(A5) U9.8(A6) U9.9(A7) U9.10(GND)
KEY0: C36.2 KEY0.4 R32.1 U9.5(A3)
KEY1: C35.2 KEY1.4 R31.1 U9.4(A2)
KEY2: C33.2 KEY2.4 R29.1 U9.3(A1)
KEY3: C32.2 KEY3.4 R20.1 U9.2(A0)
KEY.KEY0: U9.15(B3) ; port KEY.KEY0
KEY.KEY1: U9.16(B2) ; port KEY.KEY1
KEY.KEY2: U9.17(B1) ; port KEY.KEY2
KEY.KEY3: U9.18(B0) ; port KEY.KEY3
NetR19_1: R19.1 U9.19(~{OE})
NetR30_1: R30.1 U9.1(T/~{R})

Not connected (* = marked no-connect by the designer): KEY0 1(29) 3(29); KEY1 1(29) 3(29); KEY2 1(29) 3(29); KEY3 1(29) 3(29); U9 11(B7)* 12(B6)* 13(B5)* 14(B4)*

### Buses and harness runs
harness KEY = port KEY

### Library data of the parts
C32-C36 = C: Capacitor; Class I: Passive; Load: YES; Revision: July-2002: Re-released for DXP Platform.; Supplier 1: Digi-Key; Supplier Part Number 1: 311-3560-1-ND; Value: 0.1uF; Mount: SMD
KEY0-KEY3 = BUT: Switching: off-mom; Load: YES; Supplier 1: Digi-Key; Supplier Part Number 1: CKN9112CT-ND; Mount: SMD
R19 R20 R29-R32 = R: Resistor; Load: YES; Mount: SMD; Supplier 1: Digi-Key; Supplier Part Number 1: 311-10.0KHRCT-ND; Value: 10k
U9 = 74VHCV245FT: Octal Schmitt Bus Transceiver with 3-State Outputs; 01 Created By: Rodrigo Maureira @ 2018-04-05; Load: YES; ComponentLink1Description: Manufacturer Link; ComponentLink1URL: http://www.ti.com/; ComponentLink2Description: Datasheet; ComponentLink2URL: http://www-s.ti.com/sc/ds/sn54ahc245.pdf; 02 Reviewed By: *; Supplier 1: Digi-Key; Supplier Part Number 1: 74VHCV245FTCT-ND; Mount: SMD

## Sheet 06_Switch.SchDoc
size A4
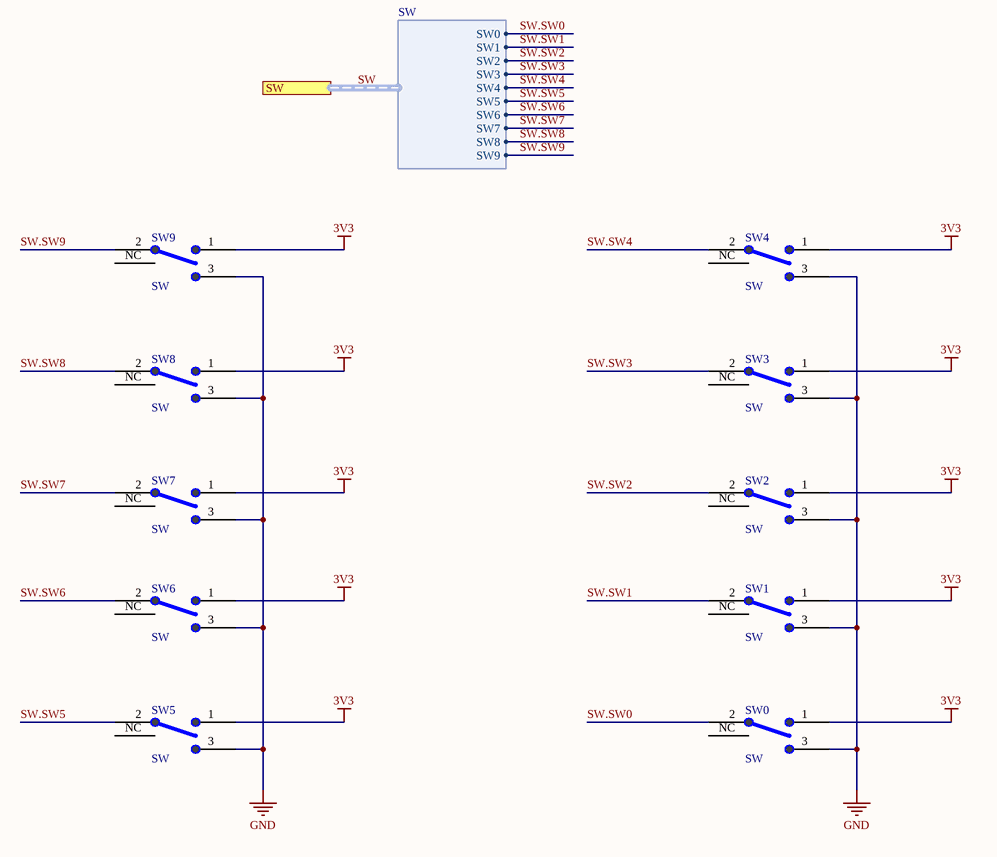
[diagram p7: 06_Switch.SchDoc]

### Parts
SW0  SW  [SW_OS102011MS2Q]
SW1  SW  [SW_OS102011MS2Q]
SW2  SW  [SW_OS102011MS2Q]
SW3  SW  [SW_OS102011MS2Q]
SW4  SW  [SW_OS102011MS2Q]
SW5  SW  [SW_OS102011MS2Q]
SW6  SW  [SW_OS102011MS2Q]
SW7  SW  [SW_OS102011MS2Q]
SW8  SW  [SW_OS102011MS2Q]
SW9  SW  [SW_OS102011MS2Q]

### Ports
SW (harness SW)

### Harnesses
SW: SW0, SW1, SW2, SW3, SW4, SW5, SW6, SW7, SW8, SW9

### Nets
3V3: SW0.1 SW1.1 SW2.1 SW3.1 SW4.1 SW5.1 SW6.1 SW7.1 SW8.1 SW9.1
GND: SW0.3 SW1.3 SW2.3 SW3.3 SW4.3 SW5.3 SW6.3 SW7.3 SW8.3 SW9.3
SW.SW0: SW0.2 ; port SW.SW0
SW.SW1: SW1.2 ; port SW.SW1
SW.SW2: SW2.2 ; port SW.SW2
SW.SW3: SW3.2 ; port SW.SW3
SW.SW4: SW4.2 ; port SW.SW4
SW.SW5: SW5.2 ; port SW.SW5
SW.SW6: SW6.2 ; port SW.SW6
SW.SW7: SW7.2 ; port SW.SW7
SW.SW8: SW8.2 ; port SW.SW8
SW.SW9: SW9.2 ; port SW.SW9

Not connected (* = marked no-connect by the designer): SW0 NC; SW1 NC; SW2 NC; SW3 NC; SW4 NC; SW5 NC; SW6 NC; SW7 NC; SW8 NC; SW9 NC

### Buses and harness runs
harness SW = port SW

### Library data of the parts
SW0-SW9 = SW: OS102011MS2QN OS Series / Miniature Slide Switches / 1-2 , 2-3 (on,on); Load: YES; Supplier 1: Digi-Key; Supplier Part Number 1: CKN9565-ND; Mount: T/H

## Sheet 10_Headers.SchDoc
size A4

## Sheet 07_HDMI.SchDoc
size A4
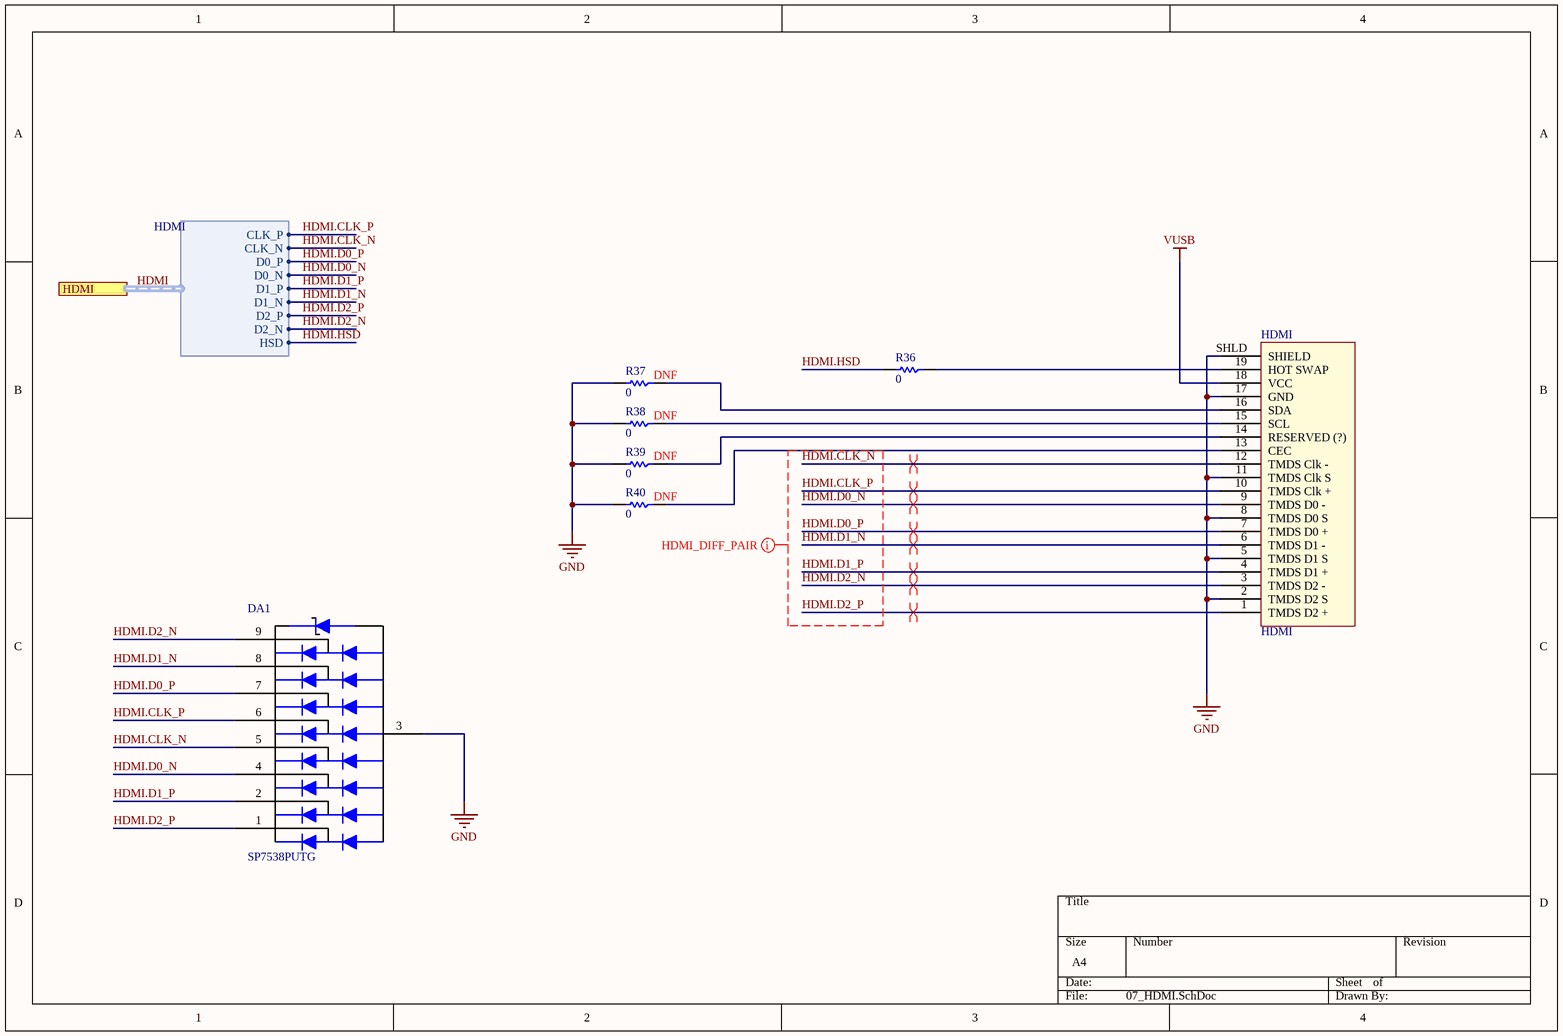
[diagram p8: 07_HDMI.SchDoc]

### Parts
DA1  SP7538PUTG  [9-UDFN]
HDMI  HDMI  [HDMI]
R36  0  [RES0402R]
R37  Load: DNF  [RES0402R]  (hidden comment: 0)
R38  Load: DNF  [RES0402R]  (hidden comment: 0)
R39  Load: DNF  [RES0402R]  (hidden comment: 0)
R40  Load: DNF  [RES0402R]  (hidden comment: 0)

### Ports
HDMI (harness HDMI)

### Harnesses
HDMI: CLK_P, CLK_N, D0_P, D0_N, D1_P, D1_N, D2_P, D2_N, HSD

### Nets
GND: DA1.3 HDMI.2(TMDS_D2_S) HDMI.5(TMDS_D1_S) HDMI.8(TMDS_D0_S) HDMI.11(TMDS_Clk_S) HDMI.17(GND) HDMI.SHLD(SHIELD) R37.2 R38.2 R39.2 R40.2
VUSB: HDMI.18(VCC)
HDMI.CLK_N: DA1.5 HDMI.12(TMDS_Clk_-) ; port HDMI.CLK_N
HDMI.CLK_P: DA1.6 HDMI.10(TMDS_Clk_+) ; port HDMI.CLK_P
HDMI.D0_N: DA1.4 HDMI.9(TMDS_D0_-) ; port HDMI.D0_N
HDMI.D0_P: DA1.7 HDMI.7(TMDS_D0_+) ; port HDMI.D0_P
HDMI.D1_N: DA1.8 HDMI.6(TMDS_D1_-) ; port HDMI.D1_N
HDMI.D1_P: DA1.2 HDMI.4(TMDS_D1_+) ; port HDMI.D1_P
HDMI.D2_N: DA1.9 HDMI.3(TMDS_D2_-) ; port HDMI.D2_N
HDMI.D2_P: DA1.1 HDMI.1(TMDS_D2_+) ; port HDMI.D2_P
HDMI.HSD: R36.2 ; port HDMI.HSD
NetHDMI_13: HDMI.13(CEC) R40.1
NetHDMI_14: HDMI.14(RESERVED_(?)) R39.1
NetHDMI_15: HDMI.15(SCL) R38.1
NetHDMI_16: HDMI.16(SDA) R37.1
NetHDMI_19: HDMI.19(HOT_SWAP) R36.1

### Buses and harness runs
harness HDMI = port HDMI

### Layout directives
differential pair: HDMI.CLK_N, HDMI.CLK_P, HDMI.D0_N, HDMI.D0_P, HDMI.D1_N, HDMI.D1_P, HDMI.D2_N, HDMI.D2_P
net class HDMI_Diff_pair: HDMI.CLK_N, HDMI.CLK_P, HDMI.D0_N, HDMI.D0_P, HDMI.D1_N, HDMI.D1_P, HDMI.D2_N, HDMI.D2_P

### Library data of the parts
DA1 = TVS ARRAY: Littelfuse Inc. SP7538PUTG; 01 Created By: Thomas Harper (12/03/2017); 02 Reviewed By: Rodrigo Maureira @ 2018-04-06; Load: YES; Published: 12-Mar-2018; Publisher: MUEEC; Supplier 1: Digi-Key; Supplier Part Number 1: F7417CT-ND; Mount: SMD
HDMI = HDMI: 19 Pin HDMI; 01 Created By: Thomas Harper @ 2018-03-12; 02 Reviewed By: Rodrigo Maureira @ 2018-04-06; Class I: Connector; Load: YES; Published: 12-Mar-2018; Publisher: MUEEC; Supplier 1: Digi-Key; Supplier Part Number 1: 609-4614-1-ND; Mount: SMD
R36 = R: Resistor; Load: YES; Mount: SMD; Supplier 1: Digi-Key; Supplier Part Number 1: 311-0.0LRCT-ND; Value: 0
R37-R40 = R: Resistor; Mount: SMD; Supplier 1: Digi-Key; Supplier Part Number 1: 311-0.0LRCT-ND; Value: 0

## Sheet 12_IR.SchDoc
size A4
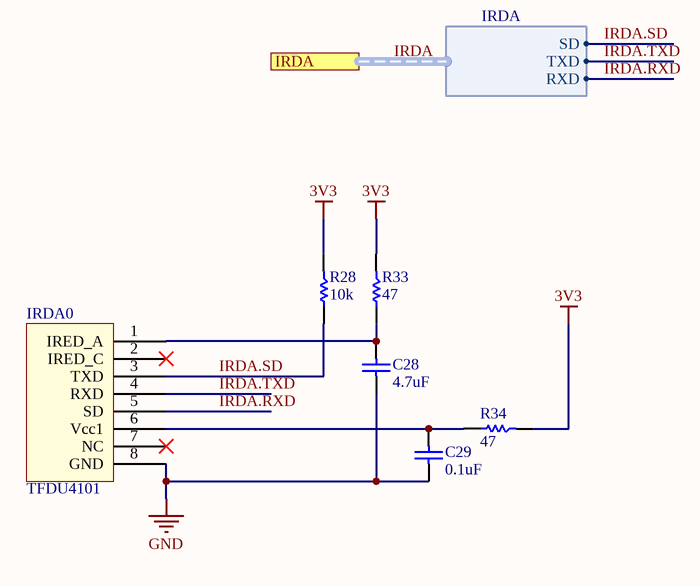
[diagram p9: 12_IR.SchDoc]

### Parts
C28  4.7uF  [CAP0805R]
C29  0.1uF  [CAP0603R]
IRDA0  TFDU4101  [TFDU4101]
R28  10k  [RES0603R]
R33  47  [RES0603R]
R34  47  [RES0603R]

### Ports
IRDA (harness IRDA)

### Harnesses
IRDA: SD, TXD, RXD

### Nets
3V3: R28.1 R33.1 R34.1
GND: C28.1 C29.2 IRDA0.8(GND)
IRDA.RXD: IRDA0.5(SD) ; port IRDA.RXD
IRDA.SD: IRDA0.3(TXD) R28.2 ; port IRDA.SD
IRDA.TXD: IRDA0.4(RXD) ; port IRDA.TXD
NetC28_2: C28.2 IRDA0.1(IRED_A) R33.2
NetC29_1: C29.1 IRDA0.6(Vcc1) R34.2

Not connected (* = marked no-connect by the designer): IRDA0 2(IRED_C)* 7(NC)*

### Buses and harness runs
harness IRDA = port IRDA

### Library data of the parts
C28 C29 = C: Capacitor; Class I: Passive; Load: YES; Revision: July-2002: Re-released for DXP Platform.; Supplier 1: Digi-Key; Mount: SMD
  C28: Supplier Part Number 1: 445-6859-1-ND; Value: 4.7uF
  C29: Supplier Part Number 1: 311-3560-1-ND; Value: 0.1uF
IRDA0 = TFDU4101: Load: YES; Supplier 1: Digi-Key; Supplier Part Number 1: 751-1071-1-ND; Mount: SMD
R28 R33 R34 = R: Resistor; Load: YES; Mount: SMD; Supplier 1: Digi-Key
  R28: Supplier Part Number 1: 311-10.0KHRCT-ND; Value: 10k
  R33 R34: Supplier Part Number 1: 311-47GRCT-ND; Value: 47

## Sheet 09_USB.SchDoc
size A3
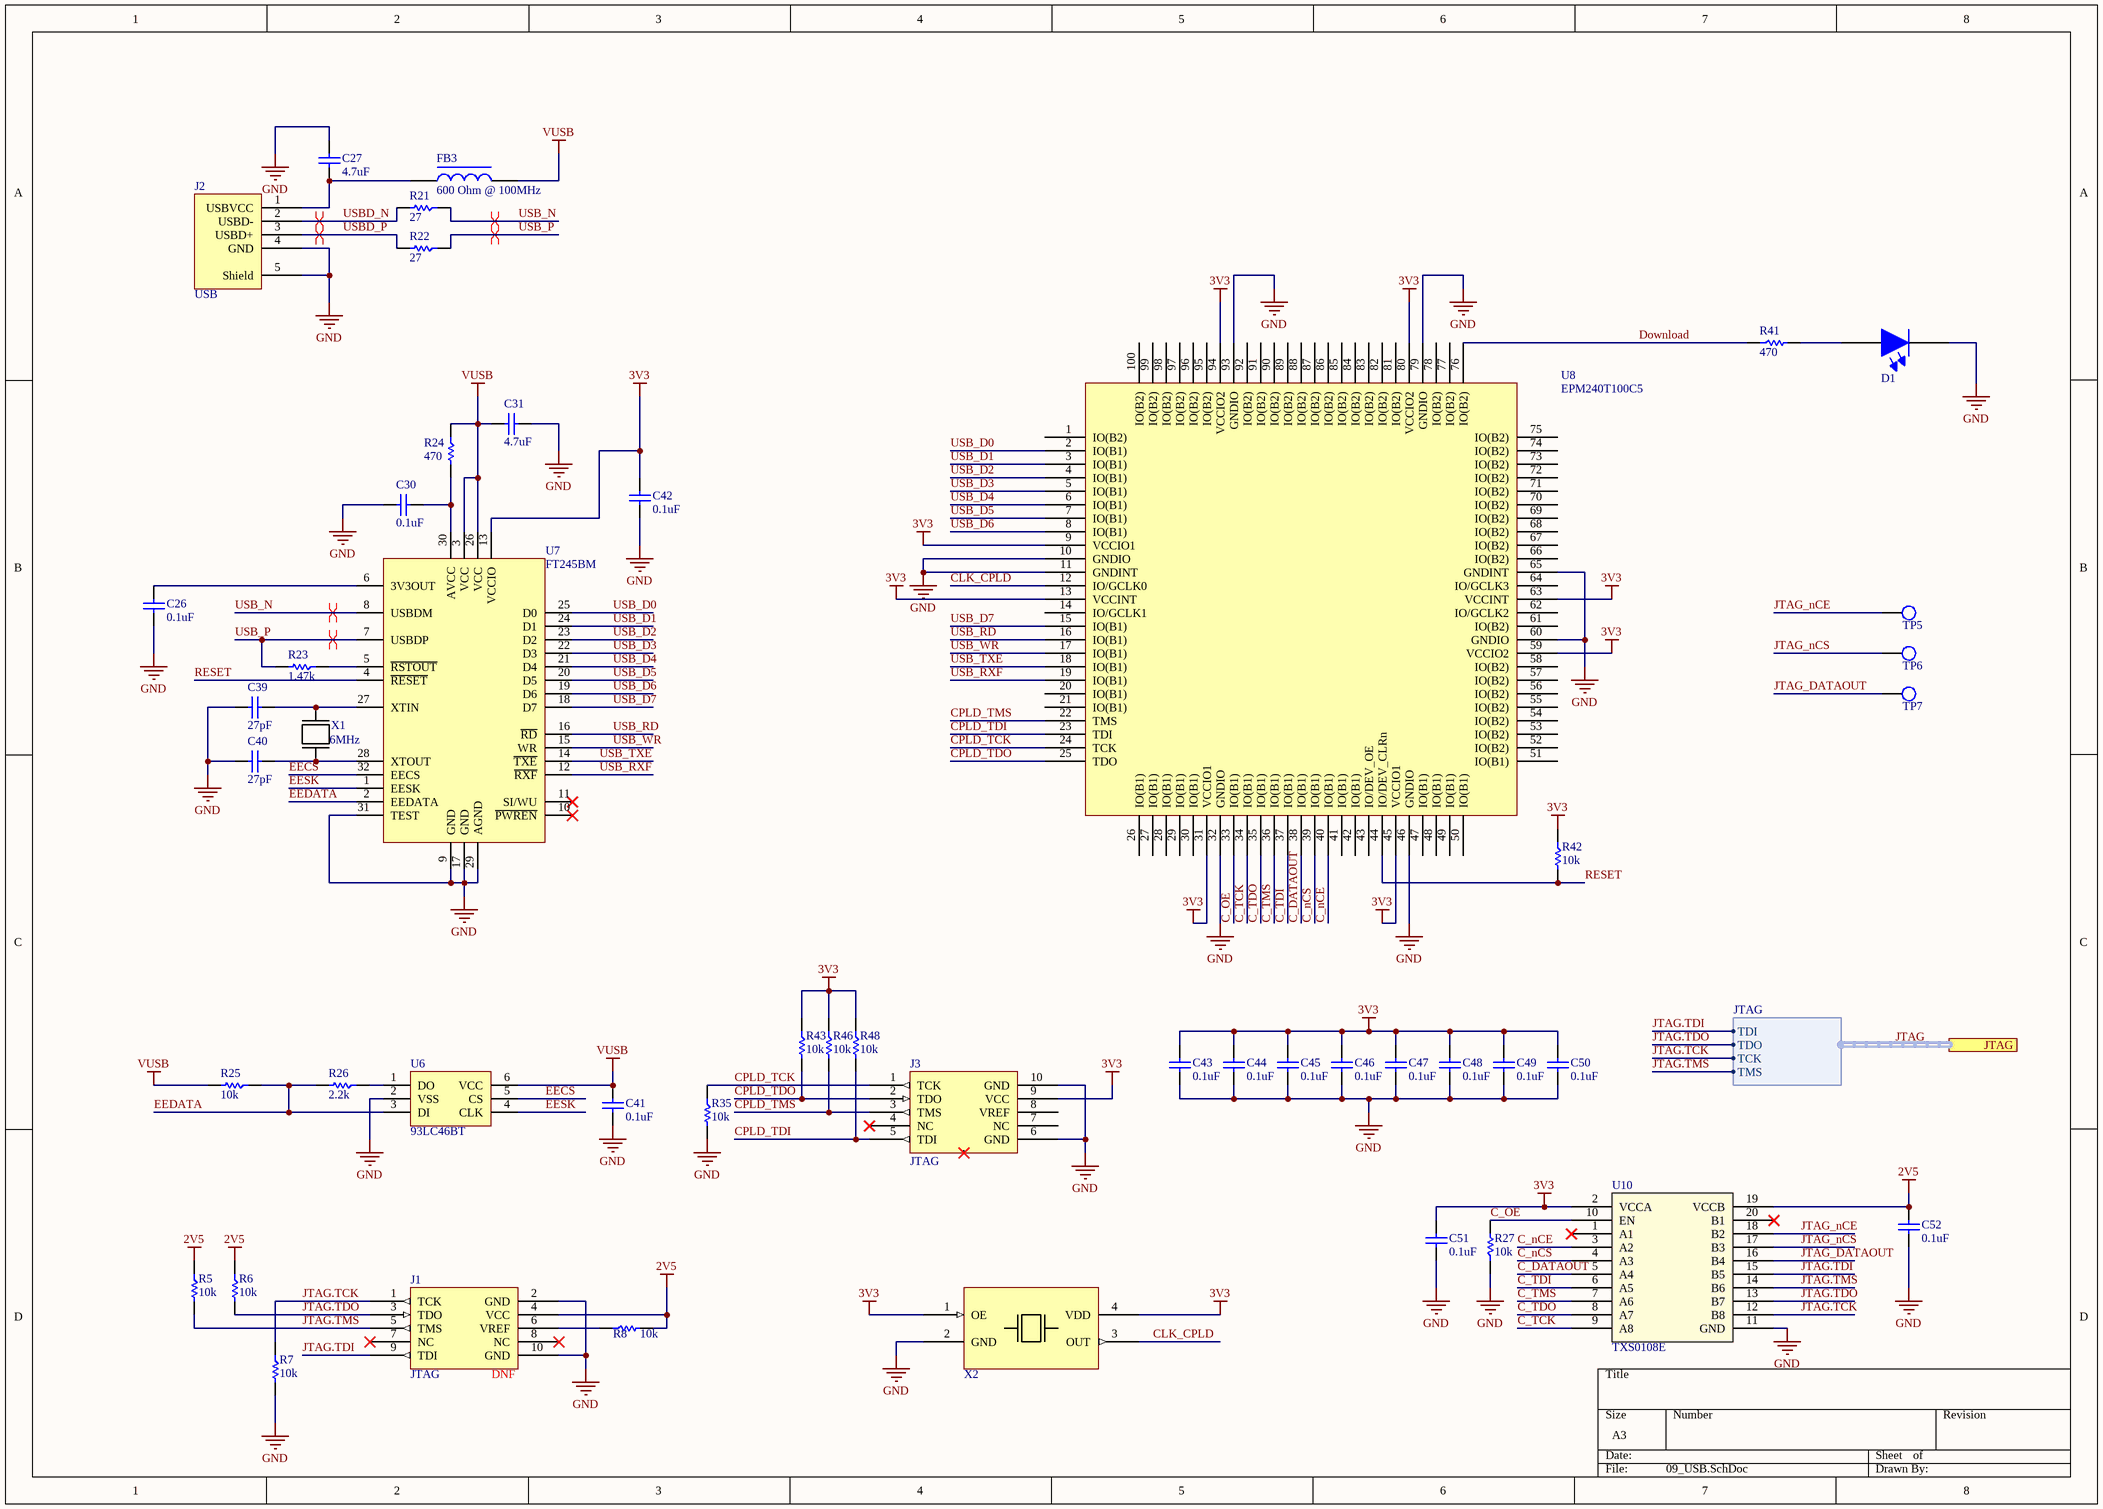
[diagram p10: 09_USB.SchDoc]

### Parts
C26  0.1uF  [CAP0402R]
C27  4.7uF  [CAP0805R]
C30  0.1uF  [CAP0402R]
C31  4.7uF  [CAP0805R]
C39  27pF  [CAP0402R]
C40  27pF  [CAP0402R]
C41  0.1uF  [CAP0402R]
C42  0.1uF  [CAP0402R]
C43  0.1uF  [CAP0402R]
C44  0.1uF  [CAP0402R]
C45  0.1uF  [CAP0402R]
C46  0.1uF  [CAP0402R]
C47  0.1uF  [CAP0402R]
C48  0.1uF  [CAP0402R]
C49  0.1uF  [CAP0402R]
C50  0.1uF  [CAP0402R]
C51  0.1uF  [CAP0402R]
C52  0.1uF  [CAP0402R]
D1  LED  [0805D-RED]  (value not drawn)
FB3  600 Ohm @ 100MHz  [RES0805R]
J1  JTAG  Load: DNF  [BOXEDVERT10]  (no BOM)
J2  USB  [USBPLUG]
J3  JTAG  [TC2050-IDC-NL]  (no BOM)
R5  10k  [RES0603R]
R6  10k  [RES0603R]
R7  10k  [RES0603R]
R8  10k  [RES0603R]
R21  27  [RES0402R]
R22  27  [RES0402R]
R23  1.47k  [RES0402R]
R24  470  [RES0402R]
R25  10k  [RES0603R]
R26  2.2k  [RES0603R]
R27  10k  [RES0603R]
R35  10k  [RES0603R]
R41  470  [RES0402R]
R42  10k  [RES0603R]
R43  10k  [RES0603R]
R46  10k  [RES0603R]
R48  10k  [RES0603R]
TP5  TestPoint  [TestPoint]  (value not drawn)  (no BOM)
TP6  TestPoint  [TestPoint]  (value not drawn)  (no BOM)
TP7  TestPoint  [TestPoint]  (value not drawn)  (no BOM)
U6  93LC46BT  [SOT23-6]
U7  FT245BM  [LQFP32]
U8  EPM240T100C5  [TQFP100-14mm]
U10  TXS0108E  [TSSOP20-4.4mm]
X1  6MHz  [HC-49/US]
X2  24Mhz Oscillator  [CX32225SB]  (value not drawn)

### Ports
JTAG (harness JTAG)

### Harnesses
JTAG: TDI, TDO, TCK, TMS

### Nets
2V5: C52.1 J1.4(VCC) R5.1 R6.1 R8.2 U10.19(VCCB)
3V3: C42.2 C43.1 C44.1 C45.1 C46.1 C47.1 C48.1 C49.1 C50.1 C51.1 J3.9(VCC) R42.1 R43.1 R46.1 R48.1 U7.13(VCCIO) U8.9(VCCIO1) U8.13(VCCINT) U8.31(VCCIO1) U8.45(VCCIO1) U8.59(VCCIO2) U8.63(VCCINT) U8.80(VCCIO2) U8.94(VCCIO2) U10.2(VCCA) X2.1(OE) X2.4(VDD)
GND: C26.2 C27.1 C30.1 C31.2 C39.1 C40.1 C41.1 C42.1 C43.2 C44.2 C45.2 C46.2 C47.2 C48.2 C49.2 C50.2 C51.2 C52.2 D1.K(CATHODE) J1.2(GND) J1.10(GND) J2.4(GND) J2.5(Shield) J3.6(GND) J3.10(GND) R7.2 R27.1 R35.2 U6.2(VSS) U7.9(GND) U7.17(GND) U7.29(AGND) U7.31(TEST) U8.10(GNDIO) U8.11(GNDINT) U8.32(GNDIO) U8.46(GNDIO) U8.60(GNDIO) U8.65(GNDINT) U8.79(GNDIO) U8.93(GNDIO) U10.11(GND) X2.2(GND)
VUSB: C31.1 C41.2 FB3.2 R24.1 R25.2 U6.6(VCC) U7.3(VCC) U7.26(VCC)
C_DATAOUT: U8.38(IO(B1)) U10.5(A4)
C_nCE: U8.40(IO(B1)) U10.3(A2)
C_nCS: U8.39(IO(B1)) U10.4(A3)
C_OE: R27.2 U8.33(IO(B1)) U10.10(EN)
C_TCK: U8.34(IO(B1)) U10.9(A8)
C_TDI: U8.37(IO(B1)) U10.6(A5)
C_TDO: U8.35(IO(B1)) U10.8(A7)
C_TMS: U8.36(IO(B1)) U10.7(A6)
CLK_CPLD: U8.12(IO/GCLK0) X2.3(OUT)
CPLD_TCK: J3.1(TCK) R35.1 U8.24(TCK)
CPLD_TDI: J3.5(TDI) R48.2 U8.23(TDI)
CPLD_TDO: J3.2(TDO) R43.2 U8.25(TDO)
CPLD_TMS: J3.3(TMS) R46.2 U8.22(TMS)
Download: R41.1 U8.76(IO(B2))
EECS: U6.5(CS) U7.32(EECS)
EEDATA: R25.1 R26.2 U6.3(DI) U7.2(EEDATA)
EESK: U6.4(CLK) U7.1(EESK)
JTAG.TCK: J1.1(TCK) R7.1 U10.12(B8) ; port JTAG.TCK
JTAG.TDI: J1.9(TDI) U10.15(B5) ; port JTAG.TDI
JTAG.TDO: J1.3(TDO) R6.2 U10.13(B7) ; port JTAG.TDO
JTAG.TMS: J1.5(TMS) R5.2 U10.14(B6) ; port JTAG.TMS
JTAG_DATAOUT: TP7.0(TP) U10.16(B4)
JTAG_nCE: TP5.0(TP) U10.18(B2)
JTAG_nCS: TP6.0(TP) U10.17(B3)
RESET: R42.2 U7.4(~{RESET}) U8.44(IO/DEV_CLRn)
USB_D0: U7.25(D0) U8.2(IO(B1))
USB_D1: U7.24(D1) U8.3(IO(B1))
USB_D2: U7.23(D2) U8.4(IO(B1))
USB_D3: U7.22(D3) U8.5(IO(B1))
USB_D4: U7.21(D4) U8.6(IO(B1))
USB_D5: U7.20(D5) U8.7(IO(B1))
USB_D6: U7.19(D6) U8.8(IO(B1))
USB_D7: U7.18(D7) U8.15(IO(B1))
USB_N: R21.1 U7.8(USBDM)
USB_P: R22.1 R23.2 U7.7(USBDP)
USB_RD: U7.16(~{RD}) U8.16(IO(B1))
USB_RXF: U7.12(~{RXF}) U8.19(IO(B1))
USB_TXE: U7.14(~{TXE}) U8.18(IO(B1))
USB_WR: U7.15(WR) U8.17(IO(B1))
USBD_N: J2.2(USBD-) R21.2
USBD_P: J2.3(USBD+) R22.2
NetC26_1: C26.1 U7.6(3V3OUT)
NetC27_2: C27.2 FB3.1 J2.1(USBVCC)
NetC30_2: C30.2 R24.2 U7.30(AVCC)
NetC39_2: C39.2 U7.27(XTIN) X1.1
NetC40_2: C40.2 U7.28(XTOUT) X1.2
NetD1_A: D1.A(ANODE) R41.2
NetJ1_6: J1.6(VREF) R8.1
NetR23_1: R23.1 U7.5(~{RSTOUT})
NetR26_1: R26.1 U6.1(DO)

Not connected (* = marked no-connect by the designer): J1 7(NC)* 8(NC)*; J3 0* 4(NC)* 7(NC) 8(VREF); U7 10(~{PWREN})* 11(SI/WU)*; U8 1(IO(B2)) 14(IO/GCLK1) 20(IO(B1)) 21(IO(B1)) 26(IO(B1)) 27(IO(B1)) 28(IO(B1)) 29(IO(B1)) 30(IO(B1)) 41(IO(B1)) 42(IO(B1)) 43(IO/DEV_OE) 47(IO(B1)) 48(IO(B1)) 49(IO(B1)) 50(IO(B1)) 51(IO(B1)) 52(IO(B2)) 53(IO(B2)) 54(IO(B2)) 55(IO(B2)) 56(IO(B2)) 57(IO(B2)) 58(IO(B2)) 61(IO(B2)) 62(IO/GCLK2) 64(IO/GCLK3) 66(IO(B2)) 67(IO(B2)) 68(IO(B2)) 69(IO(B2)) 70(IO(B2)) 71(IO(B2)) 72(IO(B2)) 73(IO(B2)) 74(IO(B2)) 75(IO(B2)) 77(IO(B2)) 78(IO(B2)) 81(IO(B2)) 82(IO(B2)) 83(IO(B2)) 84(IO(B2)) 85(IO(B2)) 86(IO(B2)) 87(IO(B2)) 88(IO(B2)) 89(IO(B2)) 90(IO(B2)) 91(IO(B2)) 92(IO(B2)) 95(IO(B2)) 96(IO(B2)) 97(IO(B2)) 98(IO(B2)) 99(IO(B2)) 100(IO(B2)); U10 1(A1)* 20(B1)*

### Buses and harness runs
harness JTAG = port JTAG

### Layout directives
differential pair: USB_N, USB_P, USBD_N, USBD_P

### Library data of the parts
C26 C27 C30 C31 C39-C52 = C: Capacitor; Class I: Passive; Load: YES; Revision: July-2002: Re-released for DXP Platform.; Supplier 1: Digi-Key; Mount: SMD
  C26 C41: Supplier Part Number 1: 311-3560-1-ND; Value: 0.1uF
  C27: Supplier Part Number 1: 445-14527-2-ND; Value: 4.7uF
  C30 C42-C52: Supplier Part Number 1: 1276-1057-1-ND; Value: 0.1uF
  C31: Supplier Part Number 1: 445-6859-1-ND; Value: 4.7uF
  C39 C40: Supplier Part Number 1: 445-5589-1-ND; Value: 27pF
D1 = LED_SMD_Generic: as LEDR0 on sheet 03_LED; Published: 12-Mar-2018; Publisher: MUEEC; Supplier 1: Digi-Key; Supplier Part Number 1: 732-4982-1-ND; Mount: SMD
FB3 = Ferrite_Bead: Ferrite Bead; Load: YES; Supplier 1: Digi-Key; Supplier Part Number 1: 445-172908-1-ND; Value: 600 Ohm @ 100MHz; Mount: SMD
J1 = JTAG_CON: JTAG connector; Supplier 1: Digi-Key; Supplier Part Number 1: ED1543-ND
J2 = USBPLUG: USB B Type Connector; Load: YES; Supplier 1: Digi-Key; Supplier Part Number 1: AE11183-ND; Mount: T/H
J3 = JTAG_CON_POGO: Contacts for TC2050-IDC-NL; 01 Created By: Rodrigo Maureira; Load: YES; Published: 18-Jun-2018; Publisher: MUEEC; Supplier 1: Digi-Key; Supplier Part Number 1: TC2050-IDC-NL-430-ND
R5-R8 R21-R27 R35 R41-R43 R46 R48 = R: Resistor; Load: YES; Mount: SMD; Supplier 1: Digi-Key
  R5-R8 R25 R27 R35 R42 R43 R46 R48: Supplier Part Number 1: 311-10.0KHRCT-ND; Value: 10k
  R21 R22: Supplier Part Number 1: YAG3086CT-ND; Value: 27
  R23: Supplier Part Number 1: YAG3038CT-ND; Value: 1.47k
  R24 R41: Supplier Part Number 1: 311-470LRCT-ND; Value: 470
  R26: Supplier Part Number 1: P2.20KLCT-ND; Value: 2.2k
TP5-TP7 = TestPoint: Test Point; Load: YES
U6 = FM93C46: 1024-Bit Serial CMOS EEPROM; Load: YES; Supplier 1: Digi-Key; Supplier Part Number 1: 93LC46BT-I/OTCT-ND; Mount: SMD
U7 = FT245BM: USB FIFO IC; Load: YES; Supplier 1: Digi-Key; Supplier Part Number 1: 768-1308-ND; Mount: SMD
U8 = EPM240T100C5: Load: YES; Supplier 1: Digi-Key; Supplier Part Number 1: 544-1964-ND; Mount: SMD
U10 = TXS0108E: 8-BIT BIDIRECTIONAL VOLTAGE-LEVEL TRANSLATOR  FOR OPEN-DRAIN AND PUSH-PULL APPLICATIONS; Load: YES; Supplier 1: Digi-Key; Supplier Part Number 1: 296-23011-1-ND; Mount: SMD
X1 = Crystal 6MHz: ECS-60-20-5PX-TR; Load: YES; Supplier Part Number 1: XC1000DKR-ND; Supplier 1: Digi-Key; Mount: SMD
X2 = 24Mhz Oscillator: 01 Created By: Rodrigo Maureira; Load: YES; Published: 18-Jun-2018; Publisher: MUEEC; Supplier 1: Digi-Key; Supplier Part Number 1: DSC6101CI1A-024.0000-ND; Mount: SMD

## Nets that join several sheets
1V2: 01_FPGA (14 pins), 02_Power (C24.1 TP3.0 U4.7)
2V5: 01_FPGA (10 pins), 02_Power (C23.1 TP2.0 U4.8), 09_USB (6 pins)
3V3: 01_FPGA (33 pins), 02_Power (8 pins), 04_7SEG (6 pins), 05_Button (7 pins), 06_Switch (10 pins), 12_IR (R28.1 R33.1 R34.1), 09_USB (27 pins)
GND: 01_FPGA (65 pins), 02_Power (7 pins), 03_LED (10 pins), 05_Button (15 pins), 06_Switch (10 pins), 07_HDMI (11 pins), 12_IR (C28.1 C29.2 IRDA0.8), 09_USB (43 pins)
VUSB: 02_Power (C21.1 TP4.0 U3.1 U3.3), 07_HDMI (HDMI.18), 09_USB (8 pins)
HDMI.CLK_N: 01_FPGA (U1.N16), 07_HDMI (DA1.5 HDMI.12)
HDMI.CLK_P: 01_FPGA (U1.N15), 07_HDMI (DA1.6 HDMI.10)
HDMI.D0_N: 01_FPGA (U1.L16), 07_HDMI (DA1.4 HDMI.9)
HDMI.D0_P: 01_FPGA (U1.L15), 07_HDMI (DA1.7 HDMI.7)
HDMI.D1_N: 01_FPGA (U1.K16), 07_HDMI (DA1.8 HDMI.6)
HDMI.D1_P: 01_FPGA (U1.K15), 07_HDMI (DA1.2 HDMI.4)
HDMI.D2_N: 01_FPGA (U1.J16), 07_HDMI (DA1.9 HDMI.3)
HDMI.D2_P: 01_FPGA (U1.J15), 07_HDMI (DA1.1 HDMI.1)
HDMI.HSD: 01_FPGA (U1.N11), 07_HDMI (R36.2)
HEX0.A: 01_FPGA (U1.F8), 04_7SEG (RA5.13)
HEX0.B: 01_FPGA (U1.F9), 04_7SEG (RA5.14)
HEX0.C: 01_FPGA (U1.C11), 04_7SEG (RA5.15)
HEX0.D: 01_FPGA (U1.E7), 04_7SEG (RA5.9)
HEX0.DP: 01_FPGA (U1.F10), 04_7SEG (RA5.16)
HEX0.E: 01_FPGA (U1.C9), 04_7SEG (RA5.12)
HEX0.F: 01_FPGA (U1.E8), 04_7SEG (RA5.11)
HEX0.G: 01_FPGA (U1.C8), 04_7SEG (RA5.10)
HEX1.A: 01_FPGA (U1.B14), 04_7SEG (RA4.13)
HEX1.B: 01_FPGA (U1.A14), 04_7SEG (RA4.14)
HEX1.C: 01_FPGA (U1.C14), 04_7SEG (RA4.15)
HEX1.D: 01_FPGA (U1.B12), 04_7SEG (RA4.9)
HEX1.DP: 01_FPGA (U1.A15), 04_7SEG (RA4.16)
HEX1.E: 01_FPGA (U1.A13), 04_7SEG (RA4.12)
HEX1.F: 01_FPGA (U1.B13), 04_7SEG (RA4.11)
HEX1.G: 01_FPGA (U1.A12), 04_7SEG (RA4.10)
HEX2.A: 01_FPGA (U1.B10), 04_7SEG (RA3.13)
HEX2.B: 01_FPGA (U1.A10), 04_7SEG (RA3.14)
HEX2.C: 01_FPGA (U1.B11), 04_7SEG (RA3.15)
HEX2.D: 01_FPGA (U1.B8), 04_7SEG (RA3.9)
HEX2.DP: 01_FPGA (U1.A11), 04_7SEG (RA3.16)
HEX2.E: 01_FPGA (U1.A9), 04_7SEG (RA3.12)
HEX2.F: 01_FPGA (U1.B9), 04_7SEG (RA3.11)
HEX2.G: 01_FPGA (U1.A8), 04_7SEG (RA3.10)
HEX3.A: 01_FPGA (U1.F7), 04_7SEG (RA2.13)
HEX3.B: 01_FPGA (U1.E6), 04_7SEG (RA2.14)
HEX3.C: 01_FPGA (U1.D6), 04_7SEG (RA2.15)
HEX3.D: 01_FPGA (U1.B6), 04_7SEG (RA2.9)
HEX3.DP: 01_FPGA (U1.F6), 04_7SEG (RA2.16)
HEX3.E: 01_FPGA (U1.A7), 04_7SEG (RA2.12)
HEX3.F: 01_FPGA (U1.B7), 04_7SEG (RA2.11)
HEX3.G: 01_FPGA (U1.A6), 04_7SEG (RA2.10)
HEX4.A: 01_FPGA (U1.C6), 04_7SEG (RA1.13)
HEX4.B: 01_FPGA (U1.E5), 04_7SEG (RA1.14)
HEX4.C: 01_FPGA (U1.D5), 04_7SEG (RA1.15)
HEX4.D: 01_FPGA (U1.B4), 04_7SEG (RA1.9)
HEX4.DP: 01_FPGA (U1.F5), 04_7SEG (RA1.16)
HEX4.E: 01_FPGA (U1.A5), 04_7SEG (RA1.12)
HEX4.F: 01_FPGA (U1.B5), 04_7SEG (RA1.11)
HEX4.G: 01_FPGA (U1.A4), 04_7SEG (RA1.10)
HEX5.A: 01_FPGA (U1.C3), 04_7SEG (RA0.13)
HEX5.B: 01_FPGA (U1.D4), 04_7SEG (RA0.14)
HEX5.C: 01_FPGA (U1.B3), 04_7SEG (RA0.15)
HEX5.D: 01_FPGA (U1.C2), 04_7SEG (RA0.9)
HEX5.DP: 01_FPGA (U1.A3), 04_7SEG (RA0.16)
HEX5.E: 01_FPGA (U1.A2), 04_7SEG (RA0.12)
HEX5.F: 01_FPGA (U1.D3), 04_7SEG (RA0.11)
HEX5.G: 01_FPGA (U1.B1), 04_7SEG (RA0.10)
IRDA.RXD: 01_FPGA (U1.N12), 12_IR (IRDA0.5)
IRDA.SD: 01_FPGA (U1.T15), 12_IR (IRDA0.3 R28.2)
IRDA.TXD: 01_FPGA (U1.P14), 12_IR (IRDA0.4)
JTAG.TCK: 01_FPGA (U1.H3), 09_USB (J1.1 R7.1 U10.12)
JTAG.TDI: 01_FPGA (U1.H4), 09_USB (J1.9 U10.15)
JTAG.TDO: 01_FPGA (U1.J4), 09_USB (J1.3 R6.2 U10.13)
JTAG.TMS: 01_FPGA (U1.J5), 09_USB (J1.5 R5.2 U10.14)
KEY.KEY0: 01_FPGA (RA8.8), 05_Button (U9.15)
KEY.KEY1: 01_FPGA (RA8.7), 05_Button (U9.16)
KEY.KEY2: 01_FPGA (RA8.6), 05_Button (U9.17)
KEY.KEY3: 01_FPGA (RA8.5), 05_Button (U9.18)
LEDR.LEDR0: 01_FPGA (RA8.3), 03_LED (LEDR0.A)
LEDR.LEDR1: 01_FPGA (RA8.1), 03_LED (LEDR1.A)
LEDR.LEDR2: 01_FPGA (RA7.7), 03_LED (LEDR2.A)
LEDR.LEDR3: 01_FPGA (RA7.5), 03_LED (LEDR3.A)
LEDR.LEDR4: 01_FPGA (RA7.3), 03_LED (LEDR4.A)
LEDR.LEDR5: 01_FPGA (RA7.1), 03_LED (LEDR5.A)
LEDR.LEDR6: 01_FPGA (RA6.7), 03_LED (LEDR6.A)
LEDR.LEDR7: 01_FPGA (RA6.5), 03_LED (LEDR7.A)
LEDR.LEDR8: 01_FPGA (RA6.3), 03_LED (LEDR8.A)
LEDR.LEDR9: 01_FPGA (RA6.1), 03_LED (LEDR9.A)
SW.SW0: 01_FPGA (RA8.4), 06_Switch (SW0.2)
SW.SW1: 01_FPGA (RA8.2), 06_Switch (SW1.2)
SW.SW2: 01_FPGA (RA7.8), 06_Switch (SW2.2)
SW.SW3: 01_FPGA (RA7.6), 06_Switch (SW3.2)
SW.SW4: 01_FPGA (RA7.4), 06_Switch (SW4.2)
SW.SW5: 01_FPGA (RA7.2), 06_Switch (SW5.2)
SW.SW6: 01_FPGA (RA6.8), 06_Switch (SW6.2)
SW.SW7: 01_FPGA (RA6.6), 06_Switch (SW7.2)
SW.SW8: 01_FPGA (RA6.4), 06_Switch (SW8.2)
SW.SW9: 01_FPGA (RA6.2), 06_Switch (SW9.2)